# Altium project AudioDSP-v3.1.1.PrjPcb
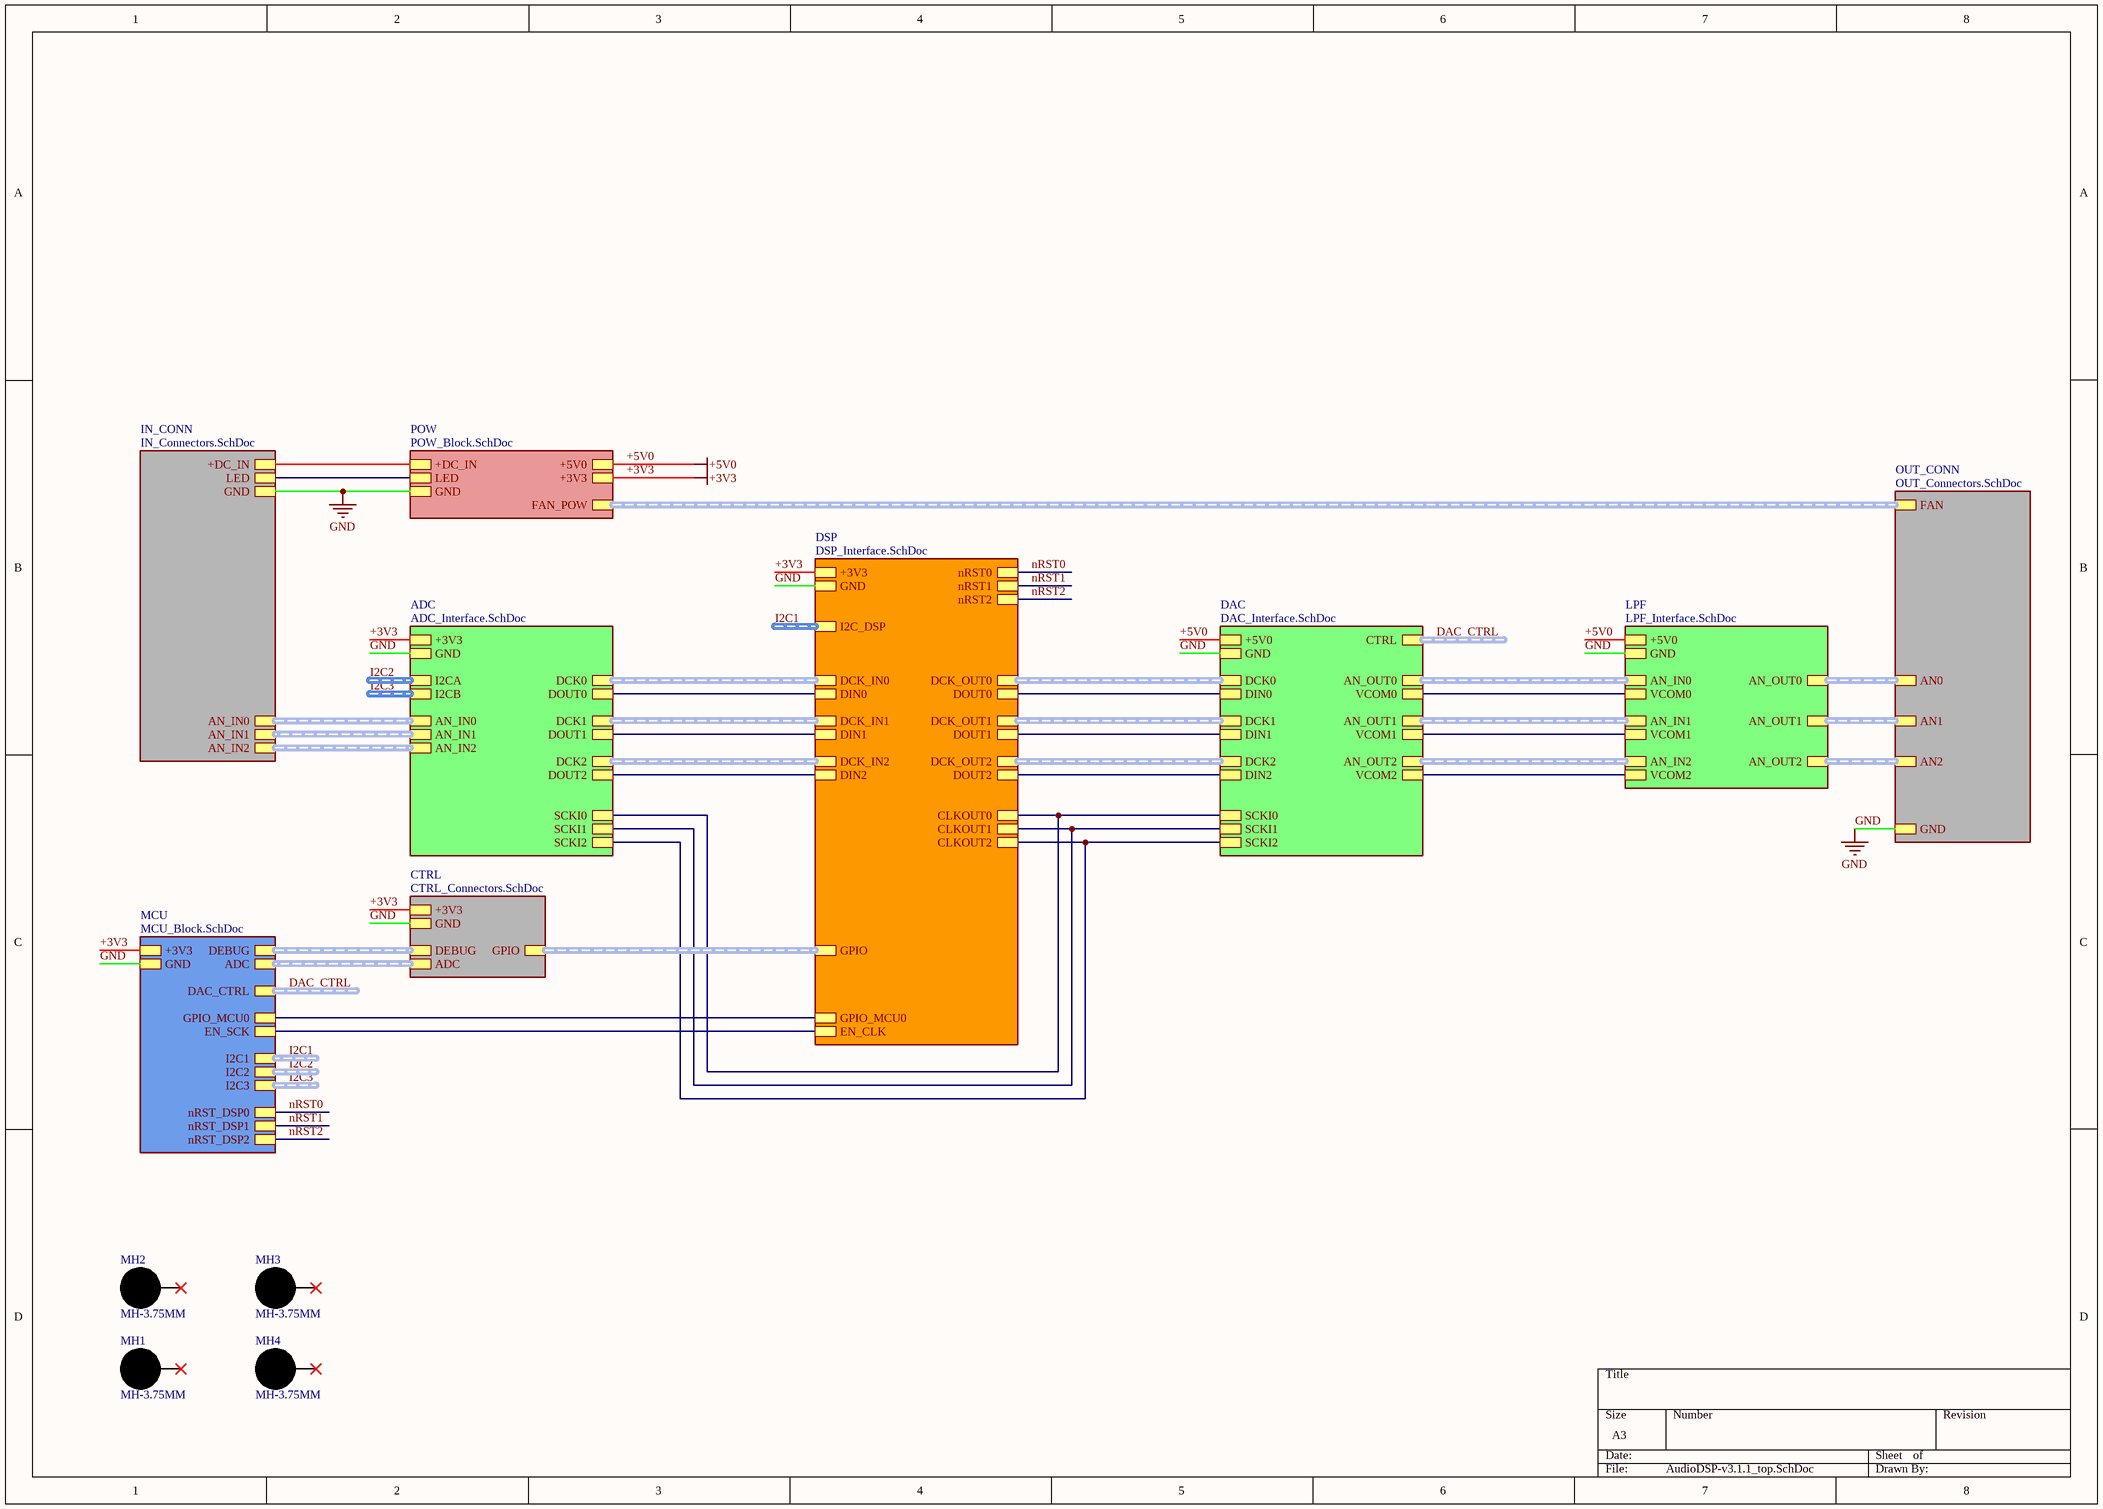
[diagram p0: AudioDSP-v3.1.1_top.SchDoc]
15 sheets, 329 parts. Net scope: strictly hierarchical (ports join the sheet entries above them; power ports are local).
Board file: AudioDSP-v3.1.1.PcbDoc
Sheets:
  AudioDSP-v3.1.1_top.SchDoc
    CTRL = CTRL_Connectors.SchDoc
    MCU = MCU_Block.SchDoc
    DSP = DSP_Interface.SchDoc
      DSP0 = DSP_Block.SchDoc
      DSP1 = DSP_Block.SchDoc
      DSP2 = DSP_Block.SchDoc
      CLK = CLK_Block.SchDoc
    DAC = DAC_Interface.SchDoc
      DAC0 = DAC_Block.SchDoc
      DAC1 = DAC_Block.SchDoc
      DAC2 = DAC_Block.SchDoc
    IN_CONN = IN_Connectors.SchDoc
    ADC = ADC_Interface.SchDoc
      ADC0 = ADC_Block.SchDoc
      ADC1 = ADC_Block.SchDoc
      ADC2 = ADC_Block.SchDoc
    LPF = LPF_Interface.SchDoc
      LPF0 = LPF_Block.SchDoc
      LPF1 = LPF_Block.SchDoc
      LPF2 = LPF_Block.SchDoc
    OUT_CONN = OUT_Connectors.SchDoc
    POW = POW_Block.SchDoc

## Sheet AudioDSP-v3.1.1_top.SchDoc
size A3; SheetNumber: 1; SheetTotal: 15

### Parts
MH1  MH-3.75MM  [MH-3.75mm-NP]  (no BOM)
MH2  MH-3.75MM  [MH-3.75mm-NP]  (no BOM)
MH3  MH-3.75MM  [MH-3.75mm-NP - SMALL]  (no BOM)
MH4  MH-3.75MM  [MH-3.75mm-NP]  (no BOM)

### Sub-sheets
ADC = ADC_Interface.SchDoc: +3V3, GND, I2CA (harness I2C), AN_IN0 (harness AN), SCKI0, I2CB (harness I2C), AN_IN1 (harness AN), AN_IN2 (harness AN), SCKI1, SCKI2, DCK0 (harness DCK), DOUT0, DCK1 (harness DCK), DOUT1, DCK2 (harness DCK), DOUT2
CTRL = CTRL_Connectors.SchDoc: DEBUG (harness SW), +3V3, GND, ADC (harness ADC), GPIO (harness GPIO)
DAC = DAC_Interface.SchDoc: +5V0, GND, SCKI0, SCKI1, SCKI2, DCK0 (harness DCK), DIN0, DCK1 (harness DCK), DIN1, DCK2 (harness DCK), DIN2, AN_OUT0 (harness AN), VCOM0, AN_OUT1 (harness AN), VCOM1, AN_OUT2 (harness AN), VCOM2, CTRL (harness DAC_CTRL)
DSP = DSP_Interface.SchDoc: +3V3, GND, I2C_DSP (harness I2C), nRST0, nRST1, nRST2, DCK_IN0 (harness DCK), DIN0, DCK_IN1 (harness DCK), DIN1, DCK_IN2 (harness DCK), DIN2, GPIO_MCU0, GPIO (harness GPIO), CLKOUT0, CLKOUT1, CLKOUT2, DCK_OUT0 (harness DCK), DOUT0, DCK_OUT1 (harness DCK), DOUT1, DCK_OUT2 (harness DCK), DOUT2, EN_CLK
IN_CONN = IN_Connectors.SchDoc: +DC_IN, GND, AN_IN0 (harness AN), LED, AN_IN1 (harness AN), AN_IN2 (harness AN)
LPF = LPF_Interface.SchDoc: +5V0, GND, AN_IN0 (harness AN), VCOM0, AN_IN1 (harness AN), VCOM1, AN_IN2 (harness AN), VCOM2, AN_OUT0 (harness AN), AN_OUT1 (harness AN), AN_OUT2 (harness AN)
MCU = MCU_Block.SchDoc: +3V3, GND, DEBUG (harness SW), ADC (harness ADC), I2C1 (harness I2C), I2C2 (harness I2C), I2C3 (harness I2C), nRST_DSP0, GPIO_MCU0, nRST_DSP1, nRST_DSP2, DAC_CTRL (harness DAC_CTRL), EN_SCK
OUT_CONN = OUT_Connectors.SchDoc: AN0 (harness AN), GND, AN1 (harness AN), AN2 (harness AN), FAN (harness FAN)
POW = POW_Block.SchDoc: +DC_IN, GND, +5V0, +3V3, LED, FAN_POW (harness FAN)

### Nets
+3V3: sheet CTRL/+3V3, sheet MCU/+3V3, sheet DSP/+3V3, sheet ADC/+3V3, sheet POW/+3V3
+5V0: sheet DAC/+5V0, sheet LPF/+5V0, sheet POW/+5V0
GND: sheet CTRL/GND, sheet MCU/GND, sheet DSP/GND, sheet DAC/GND, sheet IN_CONN/GND, sheet ADC/GND, sheet LPF/GND, sheet OUT_CONN/GND, sheet POW/GND
+DC_IN: sheet IN_CONN/+DC_IN, sheet POW/+DC_IN
DATA: sheet DSP/DOUT0, sheet DAC/DIN0
DATA: sheet DSP/DOUT1, sheet DAC/DIN1  [a separate net that carries the same name]
DATA: sheet DSP/DOUT2, sheet DAC/DIN2  [a separate net that carries the same name]
DIN0: sheet DSP/DIN0, sheet ADC/DOUT0
DIN0: sheet DSP/DIN1, sheet ADC/DOUT1  [a separate net that carries the same name]
DIN0: sheet DSP/DIN2, sheet ADC/DOUT2  [a separate net that carries the same name]
EN_SCK: sheet MCU/EN_SCK, sheet DSP/EN_CLK
GPIO_MCU0: sheet MCU/GPIO_MCU0, sheet DSP/GPIO_MCU0
nRST0: sheet MCU/nRST_DSP0, sheet DSP/nRST0
nRST1: sheet MCU/nRST_DSP1, sheet DSP/nRST1
nRST2: sheet MCU/nRST_DSP2, sheet DSP/nRST2
SCKI0: sheet DSP/CLKOUT0, sheet DAC/SCKI0, sheet ADC/SCKI0
SCKI1: sheet DSP/CLKOUT1, sheet DAC/SCKI1, sheet ADC/SCKI1
SCKI2: sheet DSP/CLKOUT2, sheet DAC/SCKI2, sheet ADC/SCKI2
VCOM: sheet DAC/VCOM0, sheet LPF/VCOM0
VCOM: sheet DAC/VCOM1, sheet LPF/VCOM1  [a separate net that carries the same name]
VCOM: sheet DAC/VCOM2, sheet LPF/VCOM2  [a separate net that carries the same name]
NetJ2_3: sheet IN_CONN/LED, sheet POW/LED

Not connected (* = marked no-connect by the designer): MH1 1*; MH2 1*; MH3 1*; MH4 1*

### Buses and harness runs
harness DAC_CTRL = sheet DAC/CTRL
harness DAC_CTRL = sheet MCU/DAC_CTRL
harness I2C1 = sheet DSP/I2C_DSP
harness I2C1 = sheet MCU/I2C1
harness I2C2 = sheet ADC/I2CA
harness I2C2 = sheet MCU/I2C2
harness I2C3 = sheet ADC/I2CB
harness I2C3 = sheet MCU/I2C3
harness sheet ADC/AN_IN0 = sheet IN_CONN/AN_IN0
harness sheet ADC/AN_IN1 = sheet IN_CONN/AN_IN1
harness sheet ADC/AN_IN2 = sheet IN_CONN/AN_IN2
harness sheet ADC/DCK0 = sheet DSP/DCK_IN0
harness sheet ADC/DCK1 = sheet DSP/DCK_IN1
harness sheet ADC/DCK2 = sheet DSP/DCK_IN2
harness sheet CTRL/ADC = sheet MCU/ADC
harness sheet CTRL/DEBUG = sheet MCU/DEBUG
harness sheet CTRL/GPIO = sheet DSP/GPIO
harness sheet DAC/AN_OUT0 = sheet LPF/AN_IN0
harness sheet DAC/AN_OUT1 = sheet LPF/AN_IN1
harness sheet DAC/AN_OUT2 = sheet LPF/AN_IN2
harness sheet DAC/DCK0 = sheet DSP/DCK_OUT0
harness sheet DAC/DCK1 = sheet DSP/DCK_OUT1
harness sheet DAC/DCK2 = sheet DSP/DCK_OUT2
harness sheet LPF/AN_OUT0 = sheet OUT_CONN/AN0
harness sheet LPF/AN_OUT1 = sheet OUT_CONN/AN1
harness sheet LPF/AN_OUT2 = sheet OUT_CONN/AN2
harness sheet OUT_CONN/FAN = sheet POW/FAN_POW

### Library data of the parts
MH1-MH4 = MH-3.75MM: ClassName: MountHole

## Sheet CTRL_Connectors.SchDoc
size A4; SheetNumber: 4; SheetTotal: 15
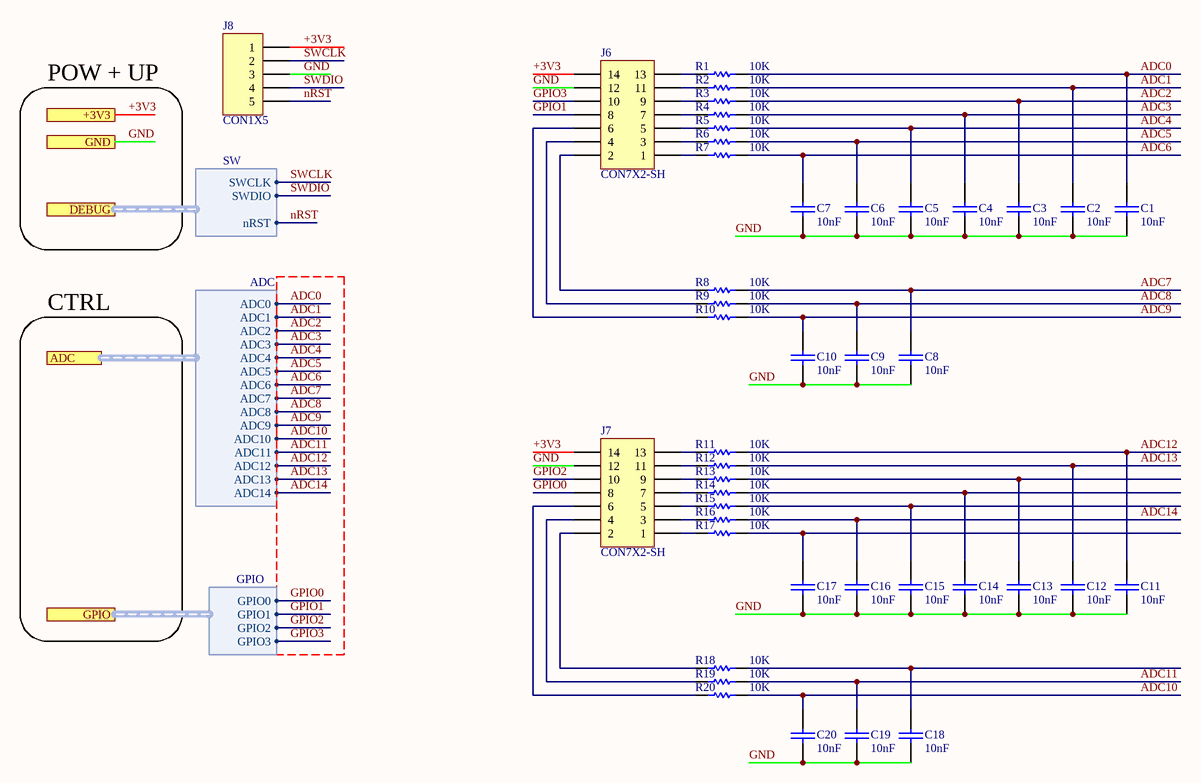
[diagram p1: CTRL_Connectors.SchDoc]

### Parts
(Parts that share a designator on the sheet are numbered #1, #2 ... from top to bottom, then left to right.)
C1#1  10nF  [0402-CAP-TDK]
C2#1  10nF  [0402-CAP-TDK]
C3#1  10nF  [0402-CAP-TDK]
C4#1  10nF  [0402-CAP-TDK]
C5#1  10nF  [0402-CAP-TDK]
C6#1  10nF  [0402-CAP-TDK]
C7#1  10nF  [0402-CAP-TDK]
C8#1  10nF  [0402-CAP-TDK]
C9#1  10nF  [0402-CAP-TDK]
C10  10nF  [0402-CAP-TDK]
C11  10nF  [0402-CAP-TDK]
C12  10nF  [0402-CAP-TDK]
C13  10nF  [0402-CAP-TDK]
C14  10nF  [0402-CAP-TDK]
C15  10nF  [0402-CAP-TDK]
C16  10nF  [0402-CAP-TDK]
C17  10nF  [0402-CAP-TDK]
C18  10nF  [0402-CAP-TDK]
C19  10nF  [0402-CAP-TDK]
C20  10nF  [0402-CAP-TDK]
J6  CON7X2-SH  [SIP7X2-SH]
J7  CON7X2-SH  [SIP7X2-SH]
J8  CON1X5  [SIP1X5]
R1#1  10K  [0402-RES-PANASONIC]
R2#1  10K  [0402-RES-PANASONIC]
R3#1  10K  [0402-RES-PANASONIC]
R4#1  10K  [0402-RES-PANASONIC]
R5#1  10K  [0402-RES-PANASONIC]
R6#1  10K  [0402-RES-PANASONIC]
R7#1  10K  [0402-RES-PANASONIC]
R8#1  10K  [0402-RES-PANASONIC]
R9#1  10K  [0402-RES-PANASONIC]
R10#1  10K  [0402-RES-PANASONIC]
R11  10K  [0402-RES-PANASONIC]
R12  10K  [0402-RES-PANASONIC]
R13  10K  [0402-RES-PANASONIC]
R14  10K  [0402-RES-PANASONIC]
R15  10K  [0402-RES-PANASONIC]
R16  10K  [0402-RES-PANASONIC]
R17  10K  [0402-RES-PANASONIC]
R18  10K  [0402-RES-PANASONIC]
R19  10K  [0402-RES-PANASONIC]
R20  10K  [0402-RES-PANASONIC]

### Ports
+3V3, ADC (harness ADC), DEBUG (harness SW), GND, GPIO (harness GPIO)

### Harnesses
SW: SWCLK, SWDIO, nRST
ADC: ADC0, ADC1, ADC2, ADC3, ADC4, ADC5, ADC6, ADC7, ADC8, ADC9, ADC10, ADC11, ADC12, ADC13, ADC14
GPIO: GPIO0, GPIO1, GPIO2, GPIO3

### Nets
+3V3: J6.14 J7.14 J8.1 ; port +3V3
GND: C1#1.1 C2#1.1 C3#1.1 C4#1.1 C5#1.1 C6#1.1 C7#1.1 C8#1.1 C9#1.1 C10.1 C11.1 C12.1 C13.1 C14.1 C15.1 C16.1 C17.1 C18.1 C19.1 C20.1 J6.12 J7.12 J8.3 ; port GND
ADC0: C1#1.2 R1#1.2 ; port ADC.ADC0
ADC1: C2#1.2 R2#1.2 ; port ADC.ADC1
ADC2: C3#1.2 R3#1.2 ; port ADC.ADC2
ADC3: C4#1.2 R4#1.2 ; port ADC.ADC3
ADC4: C5#1.2 R5#1.2 ; port ADC.ADC4
ADC5: C6#1.2 R6#1.2 ; port ADC.ADC5
ADC6: C7#1.2 R7#1.2 ; port ADC.ADC6
ADC7: C8#1.2 R8#1.2 ; port ADC.ADC7
ADC8: C9#1.2 R9#1.2 ; port ADC.ADC8
ADC9: C10.2 R10#1.2 ; port ADC.ADC9
ADC10: C20.2 R20.2 ; port ADC.ADC10
ADC11: C19.2 R19.2 ; port ADC.ADC11
ADC12: C11.2 R11.2 ; port ADC.ADC12
ADC13: C12.2 R12.2 ; port ADC.ADC13
ADC14: C16.2 R16.2 ; port ADC.ADC14
GPIO0: J7.8 ; port GPIO.GPIO0
GPIO1: J6.8 ; port GPIO.GPIO1
GPIO2: J7.10 ; port GPIO.GPIO2
GPIO3: J6.10 ; port GPIO.GPIO3
nRST: J8.5 ; port DEBUG.nRST
SWCLK: J8.2 ; port DEBUG.SWCLK
SWDIO: J8.4 ; port DEBUG.SWDIO
NetC13_2: C13.2 R13.2
NetC14_2: C14.2 R14.2
NetC15_2: C15.2 R15.2
NetC17_2: C17.2 R17.2
NetC18_2: C18.2 R18.2
NetJ6_1: J6.1 R7#1.1
NetJ6_2: J6.2 R8#1.1
NetJ6_3: J6.3 R6#1.1
NetJ6_4: J6.4 R9#1.1
NetJ6_5: J6.5 R5#1.1
NetJ6_6: J6.6 R10#1.1
NetJ6_7: J6.7 R4#1.1
NetJ6_9: J6.9 R3#1.1
NetJ6_11: J6.11 R2#1.1
NetJ6_13: J6.13 R1#1.1
NetJ7_1: J7.1 R17.1
NetJ7_2: J7.2 R18.1
NetJ7_3: J7.3 R16.1
NetJ7_4: J7.4 R19.1
NetJ7_5: J7.5 R15.1
NetJ7_6: J7.6 R20.1
NetJ7_7: J7.7 R14.1
NetJ7_9: J7.9 R13.1
NetJ7_11: J7.11 R12.1
NetJ7_13: J7.13 R11.1

### Notes on the sheet
- POW + UP
- CTRL

### Library data of the parts
C1#1 C2#1 C3#1 C4#1 C5#1 C6#1 C7#1 C8#1 C9#1 C10-C20 = CAP-SMD: JLCPart: C15195
J6 J7 = CON7X2-SH: Connector Header Through Hole 14 position 0.100" (2.54mm)
R1#1 R2#1 R3#1 R4#1 R5#1 R6#1 R7#1 R8#1 R9#1 R10#1 R11-R20 = RES-SMD: JLCPart: C25744

## Sheet MCU_Block.SchDoc
size A4; SheetNumber: 3; SheetTotal: 15
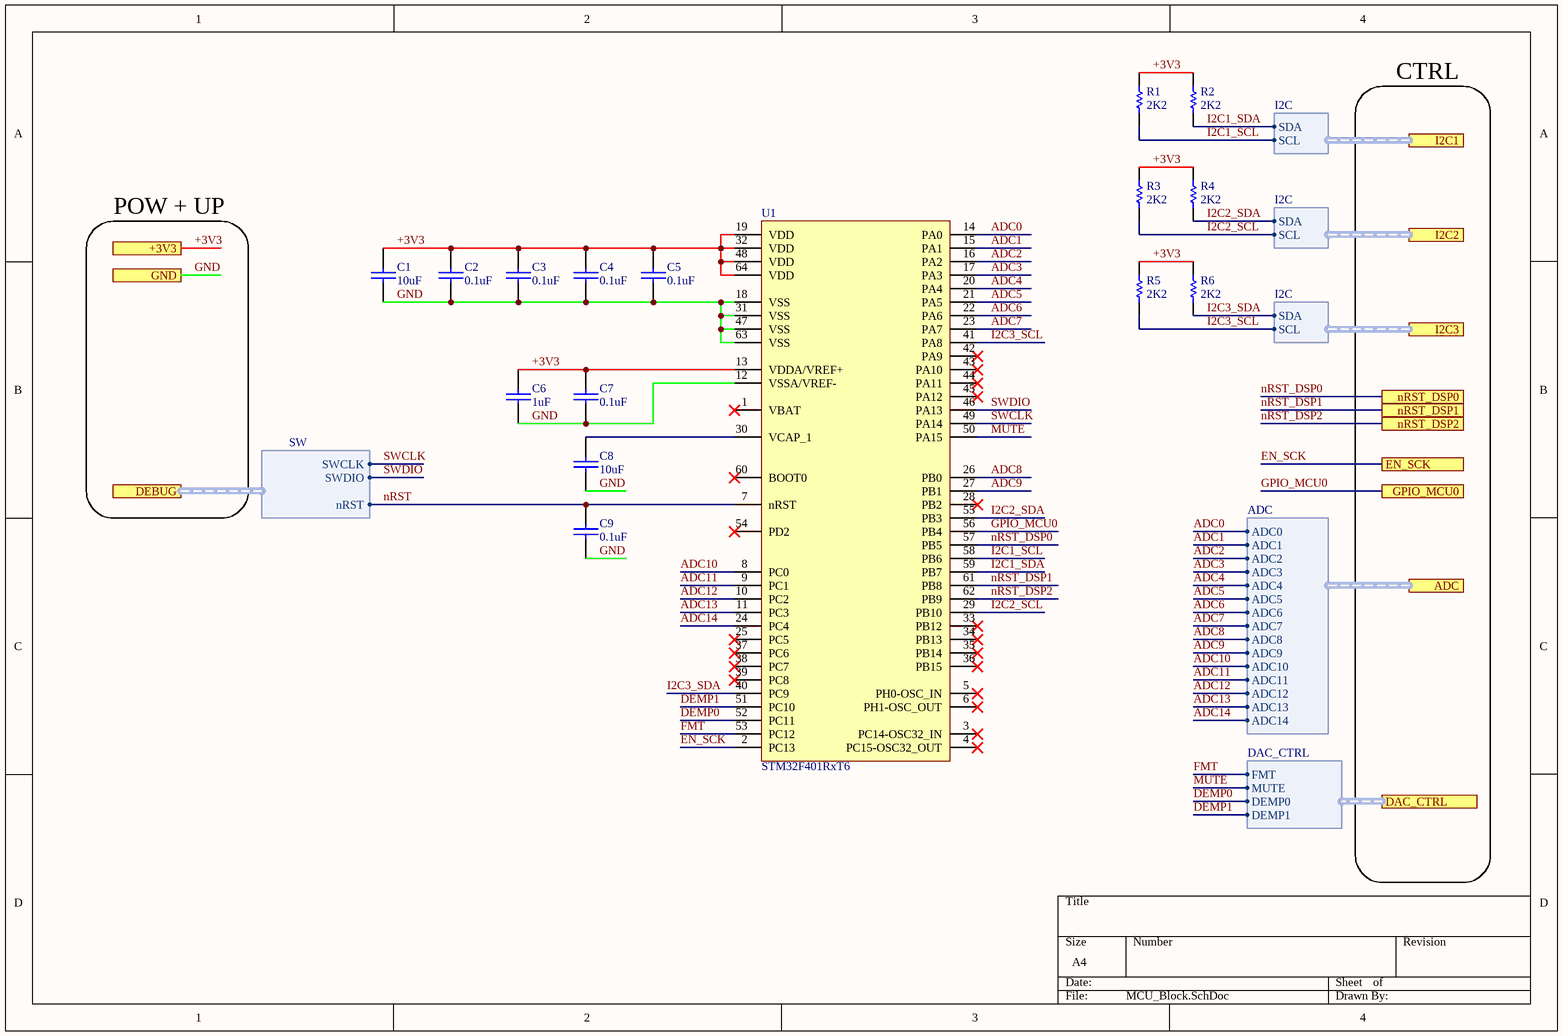
[diagram p2: MCU_Block.SchDoc]

### Parts
(Parts that share a designator on the sheet are numbered #1, #2 ... from top to bottom, then left to right.)
C1#2  10uF  [0603-CAP-TDK]
C2#2  0.1uF  [0402-CAP-TDK]
C3#2  0.1uF  [0402-CAP-TDK]
C4#2  0.1uF  [0402-CAP-TDK]
C5#2  0.1uF  [0402-CAP-TDK]
C6#2  1uF  [0603-CAP-TDK]
C7#2  0.1uF  [0402-CAP-TDK]
C8#2  10uF  [0603-CAP-TDK]
C9#2  0.1uF  [0402-CAP-TDK]
R1#2  2K2  [0402-RES-PANASONIC]
R2#2  2K2  [0402-RES-PANASONIC]
R3#2  2K2  [0402-RES-PANASONIC]
R4#2  2K2  [0402-RES-PANASONIC]
R5#2  2K2  [0402-RES-PANASONIC]
R6#2  2K2  [0402-RES-PANASONIC]
U1#1  STM32F401RxT6  [LQFP-64]

### Ports
+3V3, ADC (harness ADC), DAC_CTRL (harness DAC_CTRL), DEBUG (harness SW), EN_SCK, GND, GPIO_MCU0, I2C1 (harness I2C), I2C2 (harness I2C), I2C3 (harness I2C), nRST_DSP0, nRST_DSP1, nRST_DSP2

### Harnesses
SW: SWCLK, SWDIO, nRST
ADC: ADC0, ADC1, ADC2, ADC3, ADC4, ADC5, ADC6, ADC7, ADC8, ADC9, ADC10, ADC11, ADC12, ADC13, ADC14
I2C: SCL, SDA
DAC_CTRL: FMT, MUTE, DEMP0, DEMP1

### Nets
+3V3: C1#2.2 C2#2.2 C3#2.2 C4#2.2 C5#2.2 C6#2.2 C7#2.2 R1#2.2 R2#2.2 R3#2.2 R4#2.2 R5#2.2 R6#2.2 U1#1.13(VDDA/VREF+) U1#1.19(VDD) U1#1.32(VDD) U1#1.48(VDD) U1#1.64(VDD) ; port +3V3
GND: C1#2.1 C2#2.1 C3#2.1 C4#2.1 C5#2.1 C6#2.1 C7#2.1 C8#2.1 C9#2.1 U1#1.12(VSSA/VREF-) U1#1.18(VSS) U1#1.31(VSS) U1#1.47(VSS) U1#1.63(VSS) ; port GND
ADC0: U1#1.14(PA0) ; port ADC.ADC0
ADC1: U1#1.15(PA1) ; port ADC.ADC1
ADC2: U1#1.16(PA2) ; port ADC.ADC2
ADC3: U1#1.17(PA3) ; port ADC.ADC3
ADC4: U1#1.20(PA4) ; port ADC.ADC4
ADC5: U1#1.21(PA5) ; port ADC.ADC5
ADC6: U1#1.22(PA6) ; port ADC.ADC6
ADC7: U1#1.23(PA7) ; port ADC.ADC7
ADC8: U1#1.26(PB0) ; port ADC.ADC8
ADC9: U1#1.27(PB1) ; port ADC.ADC9
ADC10: U1#1.8(PC0) ; port ADC.ADC10
ADC11: U1#1.9(PC1) ; port ADC.ADC11
ADC12: U1#1.10(PC2) ; port ADC.ADC12
ADC13: U1#1.11(PC3) ; port ADC.ADC13
ADC14: U1#1.24(PC4) ; port ADC.ADC14
DEMP0: U1#1.52(PC11) ; port DAC_CTRL.DEMP0  [project net DAC_CTRL.DEMP0]
DEMP1: U1#1.51(PC10) ; port DAC_CTRL.DEMP1  [project net DAC_CTRL.DEMP1]
EN_SCK: U1#1.2(PC13) ; port EN_SCK
FMT: U1#1.53(PC12) ; port DAC_CTRL.FMT  [project net DAC_CTRL.FMT]
GPIO_MCU0: U1#1.56(PB4) ; port GPIO_MCU0
I2C1_SCL: R1#2.1 U1#1.58(PB6) ; port I2C1.SCL  [project net I2C1.SCL]
I2C1_SDA: R2#2.1 U1#1.59(PB7) ; port I2C1.SDA  [project net I2C1.SDA]
I2C2_SCL: R3#2.1 U1#1.29(PB10) ; port I2C2.SCL  [project net I2C2.SCL]
I2C2_SDA: R4#2.1 U1#1.55(PB3) ; port I2C2.SDA  [project net I2C2.SDA]
I2C3_SCL: R5#2.1 U1#1.41(PA8) ; port I2C3.SCL  [project net I2C3.SCL]
I2C3_SDA: R6#2.1 U1#1.40(PC9) ; port I2C3.SDA  [project net I2C3.SDA]
MUTE: U1#1.50(PA15) ; port DAC_CTRL.MUTE  [project net DAC_CTRL.MUTE]
nRST: C9#2.2 U1#1.7(nRST) ; port DEBUG.nRST
nRST_DSP0: U1#1.57(PB5) ; port nRST_DSP0  [project net nRST0]
nRST_DSP1: U1#1.61(PB8) ; port nRST_DSP1  [project net nRST1]
nRST_DSP2: U1#1.62(PB9) ; port nRST_DSP2  [project net nRST2]
SWCLK: U1#1.49(PA14) ; port DEBUG.SWCLK
SWDIO: U1#1.46(PA13) ; port DEBUG.SWDIO
NetC8#2_2: C8#2.2 U1#1.30(VCAP_1)

Not connected (* = marked no-connect by the designer): U1#1 1(VBAT)* 3(PC14-OSC32_IN)* 4(PC15-OSC32_OUT)* 5(PH0-OSC_IN)* 6(PH1-OSC_OUT)* 25(PC5)* 28(PB2)* 33(PB12)* 34(PB13)* 35(PB14)* 36(PB15)* 37(PC6)* 38(PC7)* 39(PC8)* 42(PA9)* 43(PA10)* 44(PA11)* 45(PA12)* 54(PD2)* 60(BOOT0)*

### Notes on the sheet
- CTRL
- POW + UP

### Library data of the parts
C1#2 C2#2 C3#2 C4#2 C5#2 C6#2 C7#2 C8#2 C9#2 = CAP-SMD
  C1#2 C8#2: JLCPart: C96446
  C2#2 C3#2 C4#2 C5#2 C7#2 C9#2: JLCPart: C307331
  C6#2: JLCPart: C15849
R1#2 R2#2 R3#2 R4#2 R5#2 R6#2 = RES-SMD: JLCPart: C25879
U1#1 = STM32F401RxT6: JLCPart: C74524

## Sheet DSP_Interface.SchDoc
size A4; SheetNumber: 9; SheetTotal: 15
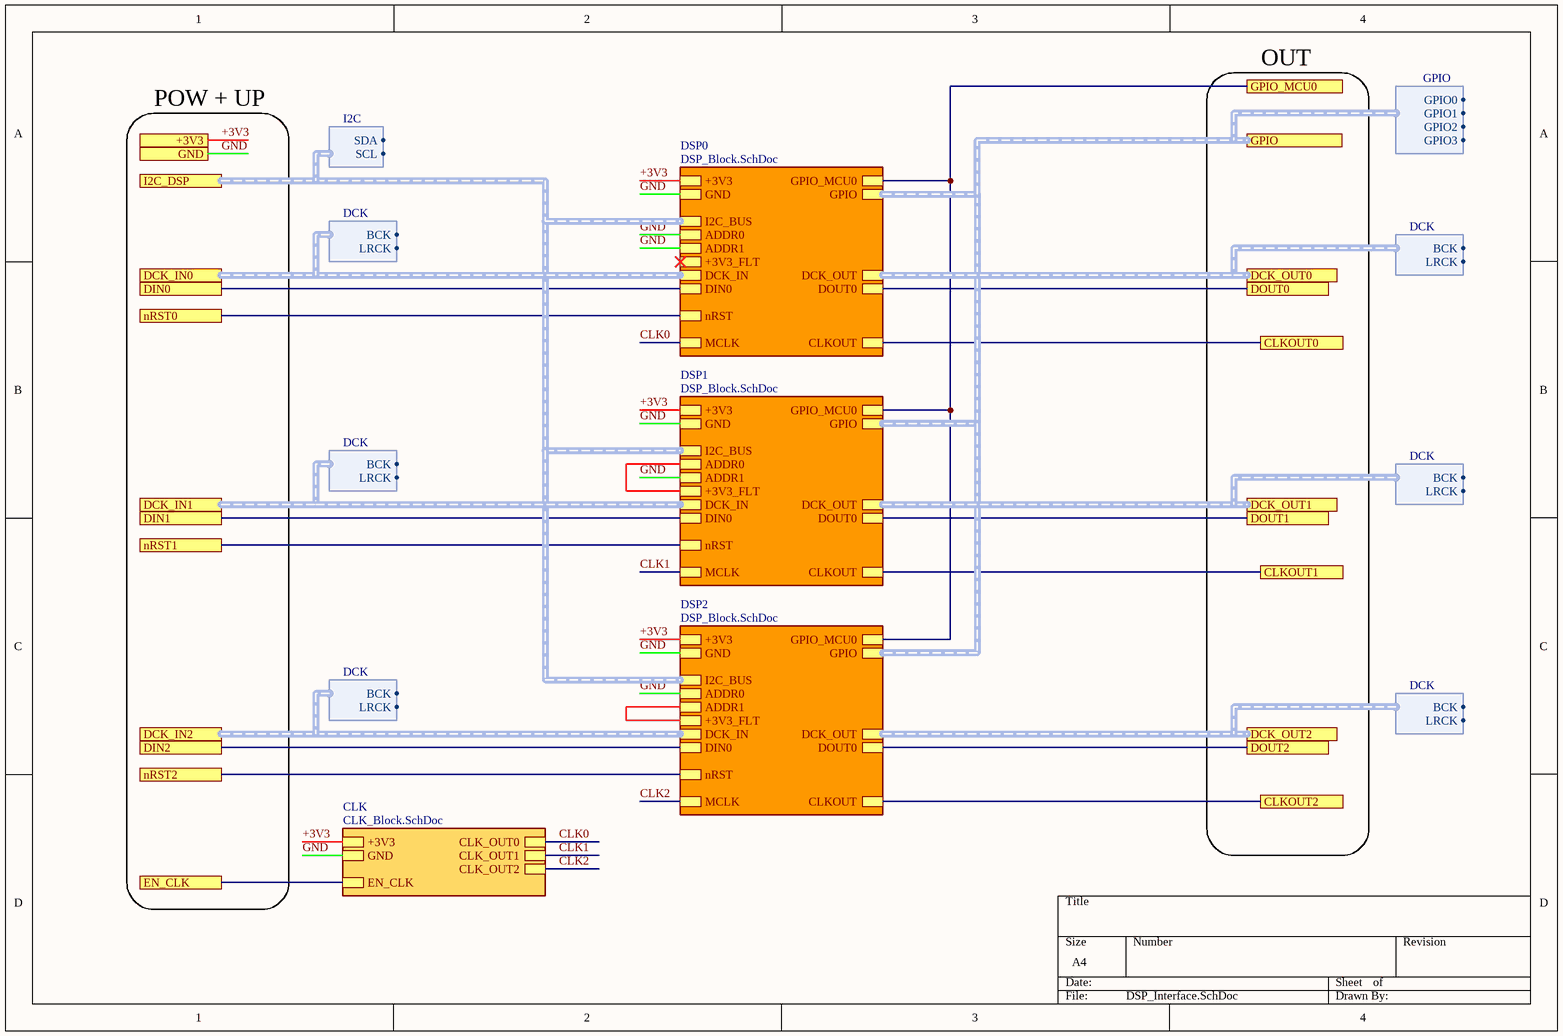
[diagram p3: DSP_Interface.SchDoc]

### Sub-sheets
CLK = CLK_Block.SchDoc: +3V3, GND, EN_CLK, CLK_OUT0, CLK_OUT1, CLK_OUT2
DSP0 = DSP_Block.SchDoc: +3V3, GND, CLKOUT, nRST, ADDR0, ADDR1, I2C_BUS (harness I2C), DCK_IN (harness DCK), DIN0, DCK_OUT (harness DCK), DOUT0, GPIO (harness GPIO), MCLK, GPIO_MCU0, +3V3_FLT
DSP1 = DSP_Block.SchDoc: +3V3, GND, CLKOUT, nRST, ADDR0, ADDR1, I2C_BUS (harness I2C), DCK_IN (harness DCK), DIN0, DCK_OUT (harness DCK), DOUT0, GPIO (harness GPIO), MCLK, GPIO_MCU0, +3V3_FLT
DSP2 = DSP_Block.SchDoc: +3V3, GND, CLKOUT, nRST, ADDR0, ADDR1, I2C_BUS (harness I2C), DCK_IN (harness DCK), DIN0, DCK_OUT (harness DCK), DOUT0, GPIO (harness GPIO), MCLK, GPIO_MCU0, +3V3_FLT

### Ports
+3V3, CLKOUT0, CLKOUT1, CLKOUT2, DCK_IN0 (harness DCK), DCK_IN1 (harness DCK), DCK_IN2 (harness DCK), DCK_OUT0 (harness DCK), DCK_OUT1 (harness DCK), DCK_OUT2 (harness DCK), DIN0, DIN1, DIN2, DOUT0, DOUT1, DOUT2, EN_CLK, GND, GPIO (harness GPIO), GPIO_MCU0, I2C_DSP (harness I2C), nRST0, nRST1, nRST2

### Harnesses
DCK: BCK, LRCK
GPIO: GPIO0, GPIO1, GPIO2, GPIO3
I2C: SCL, SDA

### Nets
+3V3: port +3V3, sheet DSP0/+3V3, sheet DSP1/+3V3, sheet DSP2/+3V3, sheet CLK/+3V3
GND: port GND, sheet DSP0/GND, sheet DSP0/ADDR0, sheet DSP0/ADDR1, sheet DSP1/GND, sheet DSP1/ADDR1, sheet DSP2/GND, sheet DSP2/ADDR0, sheet CLK/GND
+3V3_FLT_DSP1: sheet DSP1/ADDR0, sheet DSP1/+3V3_FLT
+3V3_FLT_DSP2: sheet DSP2/ADDR1, sheet DSP2/+3V3_FLT
CLK0: sheet DSP0/MCLK, sheet CLK/CLK_OUT0
CLK1: sheet DSP1/MCLK, sheet CLK/CLK_OUT1
CLK2: sheet DSP2/MCLK, sheet CLK/CLK_OUT2
DATA: port DOUT0, sheet DSP0/DOUT0
DATA: port DOUT1, sheet DSP1/DOUT0  [a separate net that carries the same name]
DATA: port DOUT2, sheet DSP2/DOUT0  [a separate net that carries the same name]
DIN0: port DIN0, sheet DSP0/DIN0
DIN0: port DIN1, sheet DSP1/DIN0  [a separate net that carries the same name]
DIN0: port DIN2, sheet DSP2/DIN0  [a separate net that carries the same name]
EN_SCK: port EN_CLK, sheet CLK/EN_CLK
GPIO_MCU0: port GPIO_MCU0, sheet DSP0/GPIO_MCU0, sheet DSP1/GPIO_MCU0, sheet DSP2/GPIO_MCU0
nRST0: port nRST0, sheet DSP0/nRST
nRST1: port nRST1, sheet DSP1/nRST
nRST2: port nRST2, sheet DSP2/nRST
SCKI0: port CLKOUT0, sheet DSP0/CLKOUT
SCKI1: port CLKOUT1, sheet DSP1/CLKOUT
SCKI2: port CLKOUT2, sheet DSP2/CLKOUT

### Buses and harness runs
harness port DCK_IN0 = sheet DSP0/DCK_IN
harness port DCK_IN1 = sheet DSP1/DCK_IN
harness port DCK_IN2 = sheet DSP2/DCK_IN
harness port DCK_OUT0 = sheet DSP0/DCK_OUT
harness port DCK_OUT1 = sheet DSP1/DCK_OUT
harness port DCK_OUT2 = sheet DSP2/DCK_OUT
harness port GPIO = sheet DSP0/GPIO = sheet DSP1/GPIO = sheet DSP2/GPIO
harness port I2C_DSP = sheet DSP0/I2C_BUS = sheet DSP1/I2C_BUS = sheet DSP2/I2C_BUS

### Notes on the sheet
- POW + UP
- OUT

## Sheet DSP_Block.SchDoc
size A4; SheetNumber: 10; SheetTotal: 15
Used 3 times, as channels DSP/DSP0, DSP/DSP1, DSP/DSP2. Parts and nets are listed once, with the designators drawn on the sheet.
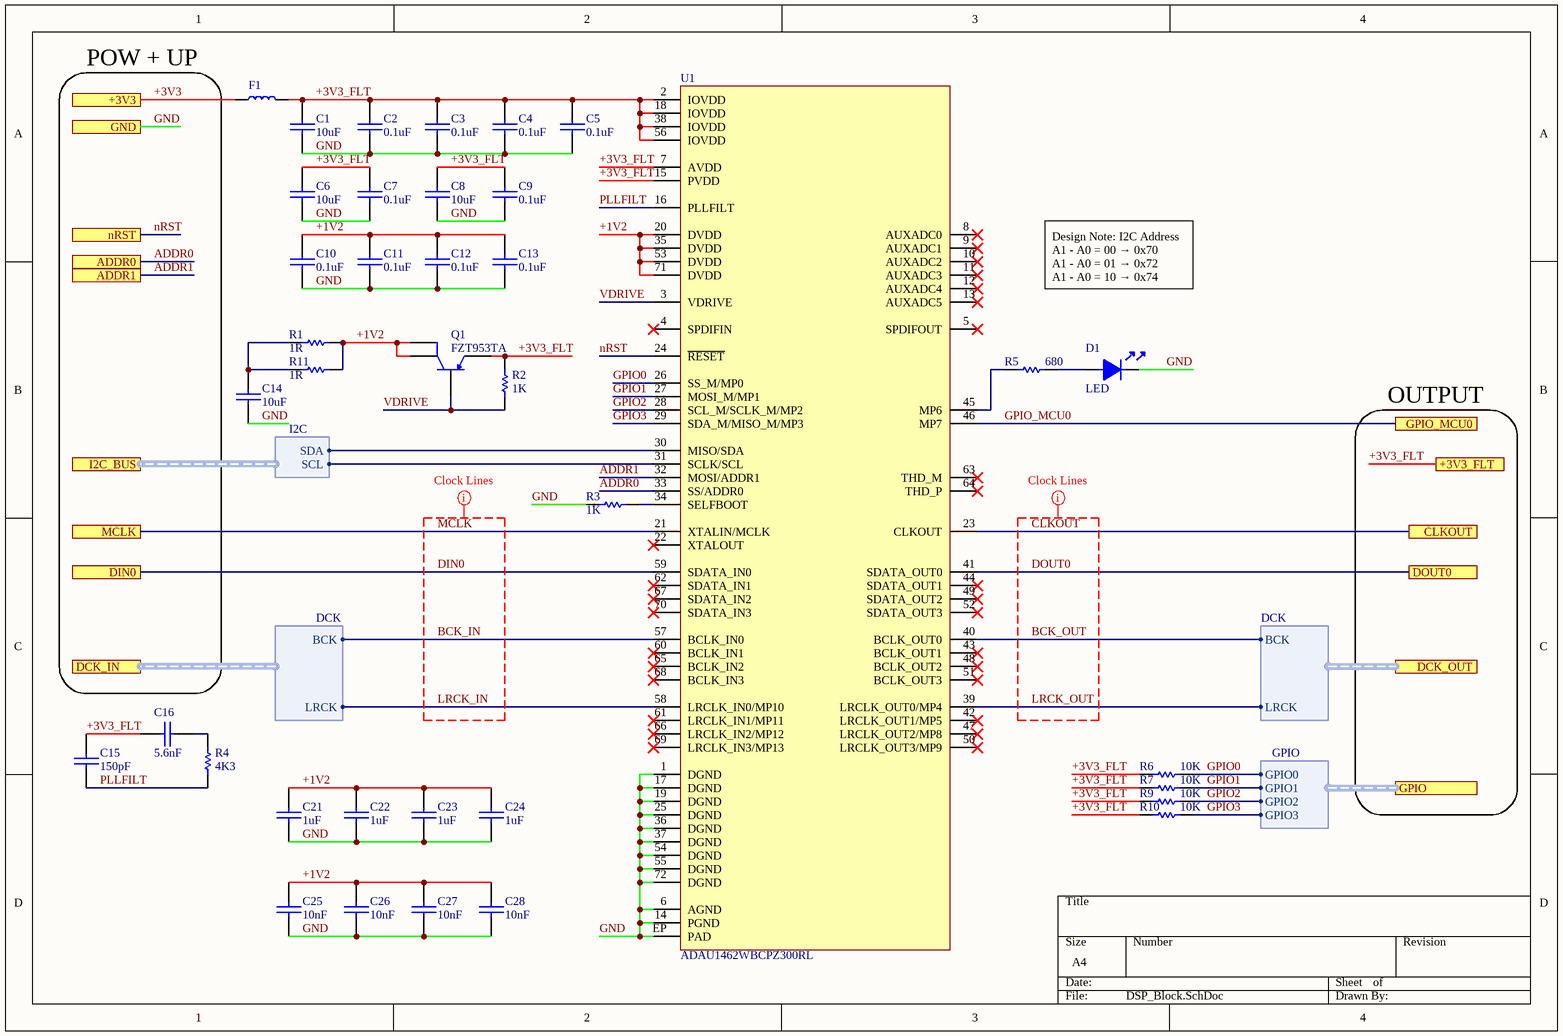
[diagram p4: DSP_Block.SchDoc]

### Parts
C1  10uF  [0402-CAP-TDK]
C2  0.1uF  [0402-CAP-TDK]
C3  0.1uF  [0402-CAP-TDK]
C4  0.1uF  [0402-CAP-TDK]
C5  0.1uF  [0402-CAP-TDK]
C6  10uF  [0402-CAP-TDK]
C7  0.1uF  [0402-CAP-TDK]
C8  10uF  [0402-CAP-TDK]
C9  0.1uF  [0402-CAP-TDK]
C10  0.1uF  [0402-CAP-TDK]
C11  0.1uF  [0402-CAP-TDK]
C12  0.1uF  [0402-CAP-TDK]
C13  0.1uF  [0402-CAP-TDK]
C14  10uF  [0402-CAP-TDK]
C15  150pF  [0402-CAP-TDK]
C16  5.6nF  [0402-CAP-TDK]
C21  1uF  [0402-CAP-TDK]
C22  1uF  [0402-CAP-TDK]
C23  1uF  [0402-CAP-TDK]
C24  1uF  [0402-CAP-TDK]
C25  10nF  [0402-CAP-TDK]
C26  10nF  [0402-CAP-TDK]
C27  10nF  [0402-CAP-TDK]
C28  10nF  [0402-CAP-TDK]
D1  LED  [LED-0805]
F1  BLM18PG181SN1D  [0603-IND-MURATA]  (value not drawn)
Q1  FZT953TA  [SOT223-DN]
R1  1R  [0603-RES-PANASONIC]
R2  1K  [0402-RES-PANASONIC]
R3  1K  [0402-RES-PANASONIC]
R4  4K3  [0402-RES-PANASONIC]
R5  680  [0402-RES-PANASONIC]
R6  10K  [0402-RES-PANASONIC]
R7  10K  [0402-RES-PANASONIC]
R9  10K  [0402-RES-PANASONIC]
R10  10K  [0402-RES-PANASONIC]
R11  1R  [0603-RES-PANASONIC]
U1  ADAU1462WBCPZ300RL  [LFCSP-VQ-72]

### Ports
+3V3, +3V3_FLT, ADDR0, ADDR1, CLKOUT, DCK_IN (harness DCK), DCK_OUT (harness DCK), DIN0, DOUT0, GND, GPIO (harness GPIO), GPIO_MCU0, I2C_BUS (harness I2C), MCLK, nRST

### Harnesses
I2C: SCL, SDA
DCK: BCK, LRCK
GPIO: GPIO0, GPIO1, GPIO2, GPIO3

### Nets
+1V2: C10.2 C11.2 C12.2 C13.2 C21.2 C22.2 C23.2 C24.2 C25.2 C26.2 C27.2 C28.2 Q1.C Q1.C-TAB R1.1 R11.1 U1.20(DVDD) U1.35(DVDD) U1.53(DVDD) U1.71(DVDD)
+3V3: F1.2 ; port +3V3
+3V3_FLT: C1.2 C2.2 C3.2 C4.2 C5.2 C6.2 C7.2 C8.2 C9.2 C15.2 C16.2 F1.1 Q1.E R2.2 R6.1 R7.2 R9.1 R10.2 U1.2(IOVDD) U1.7(AVDD) U1.15(PVDD) U1.18(IOVDD) U1.38(IOVDD) U1.56(IOVDD) ; port +3V3_FLT
ADDR0: U1.33(SS/ADDR0) ; port ADDR0
ADDR1: U1.32(MOSI/ADDR1) ; port ADDR1
BCK_IN: U1.57(BCLK_IN0) ; port DCK_IN.BCK
BCK_OUT: U1.40(BCLK_OUT0) ; port DCK_OUT.BCK
CLKOUT: U1.23(CLKOUT) ; port CLKOUT
DIN0: U1.59(SDATA_IN0) ; port DIN0
DOUT0: U1.41(SDATA_OUT0) ; port DOUT0
GND: C1.1 C2.1 C3.1 C4.1 C5.1 C6.1 C7.1 C8.1 C9.1 C10.1 C11.1 C12.1 C13.1 C14.1 C21.1 C22.1 C23.1 C24.1 C25.1 C26.1 C27.1 C28.1 D1.2 R3.2 U1.1(DGND) U1.6(AGND) U1.14(PGND) U1.17(DGND) U1.19(DGND) U1.25(DGND) U1.36(DGND) U1.37(DGND) U1.54(DGND) U1.55(DGND) U1.72(DGND) U1.EP(PAD) ; port GND
GPIO0: R6.2 U1.26(SS_M/MP0) ; port GPIO.GPIO0
GPIO1: R7.1 U1.27(MOSI_M/MP1) ; port GPIO.GPIO1
GPIO2: R9.2 U1.28(SCL_M/SCLK_M/MP2) ; port GPIO.GPIO2
GPIO3: R10.1 U1.29(SDA_M/MISO_M/MP3) ; port GPIO.GPIO3
GPIO_MCU0: U1.46(MP7) ; port GPIO_MCU0
LRCK_IN: U1.58(LRCLK_IN0/MP10) ; port DCK_IN.LRCK
LRCK_OUT: U1.39(LRCLK_OUT0/MP4) ; port DCK_OUT.LRCK
MCLK: U1.21(XTALIN/MCLK) ; port MCLK
nRST: U1.24(~{RESET}) ; port nRST
PLLFILT: C15.1 R4.1 U1.16(PLLFILT)
VDRIVE: Q1.B R2.1 U1.3(VDRIVE)
NetC14_2: C14.2 R1.2 R11.2
NetC16_1: C16.1 R4.2
NetD1_1: D1.1 R5.2
NetR3_1: R3.1 U1.34(SELFBOOT)
NetR5_1: R5.1 U1.45(MP6)
NetU1_30: U1.30(MISO/SDA) ; port I2C_BUS.SDA
NetU1_31: U1.31(SCLK/SCL) ; port I2C_BUS.SCL

Not connected (* = marked no-connect by the designer): U1 4(SPDIFIN)* 5(SPDIFOUT)* 8(AUXADC0)* 9(AUXADC1)* 10(AUXADC2)* 11(AUXADC3)* 12(AUXADC4)* 13(AUXADC5)* 22(XTALOUT)* 42(LRCLK_OUT1/MP5)* 43(BCLK_OUT1)* 44(SDATA_OUT1)* 47(LRCLK_OUT2/MP8)* 48(BCLK_OUT2)* 49(SDATA_OUT2)* 50(LRCLK_OUT3/MP9)* 51(BCLK_OUT3)* 52(SDATA_OUT3)* 60(BCLK_IN1)* 61(LRCLK_IN1/MP11)* 62(SDATA_IN1)* 63(THD_M)* 64(THD_P)* 65(BCLK_IN2)* 66(LRCLK_IN2/MP12)* 67(SDATA_IN2)* 68(BCLK_IN3)* 69(LRCLK_IN3/MP13)* 70(SDATA_IN3)*

### Channels
DSP/DSP0: designators end in _DSP0; ports +3V3=+3V3 +3V3_FLT=+3V3_FLT_DSP0 ADDR0=GND ADDR1=GND CLKOUT=SCKI0 DIN0=DIN0 DOUT0=DATA GND=GND GPIO_MCU0=GPIO_MCU0 MCLK=CLK0 nRST=nRST0
DSP/DSP1: designators end in _DSP1; ports +3V3=+3V3 +3V3_FLT=+3V3_FLT_DSP1 ADDR0=+3V3_FLT_DSP1 ADDR1=GND CLKOUT=SCKI1 DIN0=DIN0 DOUT0=DATA GND=GND GPIO_MCU0=GPIO_MCU0 MCLK=CLK1 nRST=nRST1
DSP/DSP2: designators end in _DSP2; ports +3V3=+3V3 +3V3_FLT=+3V3_FLT_DSP2 ADDR0=GND ADDR1=+3V3_FLT_DSP2 CLKOUT=SCKI2 DIN0=DIN0 DOUT0=DATA GND=GND GPIO_MCU0=GPIO_MCU0 MCLK=CLK2 nRST=nRST2

### Layout directives
net class CLK: BCK_IN, BCK_OUT, CLKOUT, DIN0, DOUT0, LRCK_IN, LRCK_OUT, MCLK

### Notes on the sheet
- POW + UP
- Design Note: I2C Address
  A1 - A0 = 00 → 0x70
  A1 - A0 = 01 → 0x72
  A1 - A0 = 10 → 0x74
- OUTPUT

### Library data of the parts
C1-C16 C21-C28 = CAP-SMD
  C1 C6 C8 C14: JLCPart: C324476
  C2-C5 C7 C9-C13: JLCPart: C307331
  C15: JLCPart: C237333
  C16: JLCPart: C513725
  C21-C24: JLCPart: C52923
  C25-C28: JLCPart: C15195
D1 = LED-SMD: JLCPart: C84256
F1 = BLM18PG181SN1D: 90mΩ ±25% 180Ω@100MHz 1.5A - 0603; JLCPart: C82850; Digikey_PN: 490-5263-1-ND
Q1 = FZT953TA: Bipolar (BJT) Transistor PNP 100 V 5 A 120MHz 3 W Surface Mount SOT-223-3; Digikey_PN: FZT953CT-ND; JLCPart: C110507
R1-R7 R9-R11 = RES-SMD
  R1 R11: JLCPart: C22936
  R2 R3: JLCPart: C11702
  R4: JLCPart: C477725
  R5: JLCPart: C25130
  R6 R7 R9 R10: JLCPart: C25744
U1 = ADAU1462WBCPZ300RL: SigmaDSP 294.912 MHz, 32-bit Audio Processor; JLCPart: C654408

## Sheet CLK_Block.SchDoc
size A4; SheetNumber: 11; SheetTotal: 15
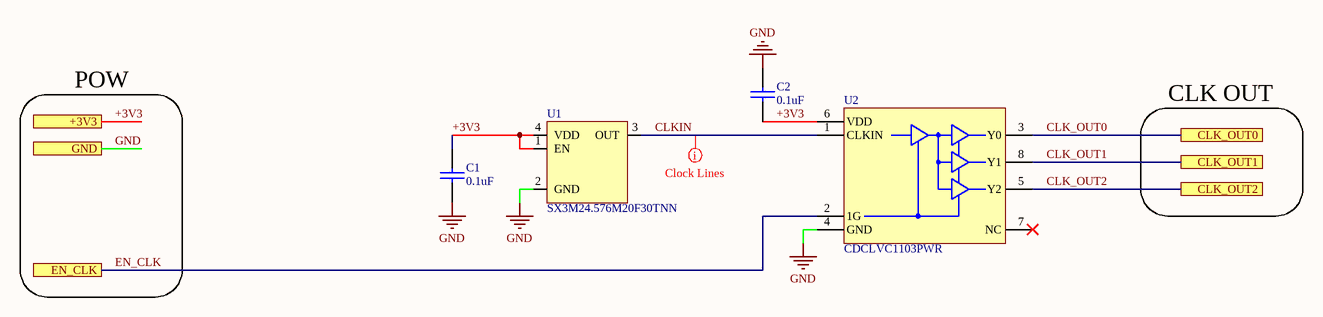
[diagram p5: CLK_Block.SchDoc]

### Parts
(Parts that share a designator on the sheet are numbered #1, #2 ... from top to bottom, then left to right.)
C1#3  0.1uF  [0402-CAP-TDK]
C2#3  0.1uF  [0402-CAP-TDK]
U1#2  SX3M24.576M20F30TNN  [SMD3225]
U2#1  CDCLVC1103PWR  [TI-TSSOP-8-PW0008A]

### Ports
+3V3, CLK_OUT0, CLK_OUT1, CLK_OUT2, EN_CLK, GND

### Nets
+3V3: C1#3.2 C2#3.1 U1#2.1(EN) U1#2.4(VDD) U2#1.6(VDD) ; port +3V3
GND: C1#3.1 C2#3.2 U1#2.2(GND) U2#1.4(GND) ; port GND
CLK_OUT0: U2#1.3(Y0) ; port CLK_OUT0  [project net CLK0]
CLK_OUT1: U2#1.8(Y1) ; port CLK_OUT1  [project net CLK1]
CLK_OUT2: U2#1.5(Y2) ; port CLK_OUT2  [project net CLK2]
CLKIN: U1#2.3(OUT) U2#1.1(CLKIN)
EN_CLK: U2#1.2(1G) ; port EN_CLK  [project net EN_SCK]

Not connected (* = marked no-connect by the designer): U2#1 7(NC)*

### Layout directives
net class CLK: CLKIN

### Notes on the sheet
- POW
- CLK OUT

### Library data of the parts
C1#3 C2#3 = CAP-SMD: JLCPart: C307331
U1#2 = SX3M24.576M20F30TNN: 1.62V-3.63V ±20ppm 24.576MHz SMD3225-4P Oscillators; JLCPart: C2901574
U2#1 = CDCLVC1103PWR: LVCMOS High-Performance Clock Buffer 3-Output; JLCPart: C555453

## Sheet DAC_Interface.SchDoc
size A4; SheetNumber: 8; SheetTotal: 16
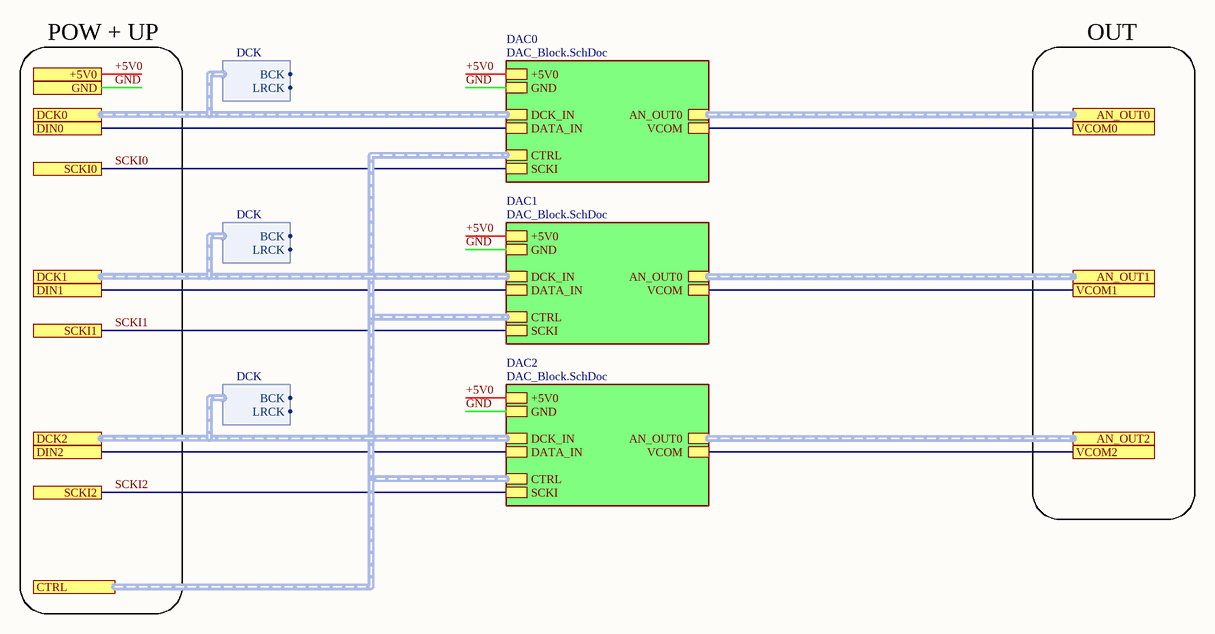
[diagram p6: DAC_Interface.SchDoc]

### Sub-sheets
DAC0 = DAC_Block.SchDoc: GND, +5V0, VCOM, DATA_IN, DCK_IN (harness DCK), SCKI, AN_OUT0 (harness AN), CTRL (harness DAC_CTRL)
DAC1 = DAC_Block.SchDoc: GND, +5V0, VCOM, DATA_IN, DCK_IN (harness DCK), SCKI, AN_OUT0 (harness AN), CTRL (harness DAC_CTRL)
DAC2 = DAC_Block.SchDoc: GND, +5V0, VCOM, DATA_IN, DCK_IN (harness DCK), SCKI, AN_OUT0 (harness AN), CTRL (harness DAC_CTRL)

### Ports
+5V0 (see AudioDSP-v3.1.1_top[5B], DAC_Block[1B], LPF_Block[1B], LPF_Interface[1A], POW_Block[4A]), AN_OUT0 (harness AN, see AudioDSP-v3.1.1_top[6B], DAC_Block[4B]), AN_OUT1 (harness AN, see AudioDSP-v3.1.1_top[6B]), AN_OUT2 (harness AN, see AudioDSP-v3.1.1_top[6C]), CTRL (harness DAC_CTRL, see AudioDSP-v3.1.1_top[6B], DAC_Block[1B]), DCK0 (harness DCK, see AudioDSP-v3.1.1_top[5B]), DCK1 (harness DCK, see AudioDSP-v3.1.1_top[5B]), DCK2 (harness DCK, see AudioDSP-v3.1.1_top[5C]), DIN0 (see AudioDSP-v3.1.1_top[5B]), DIN1 (see AudioDSP-v3.1.1_top[5B]), DIN2 (see AudioDSP-v3.1.1_top[5C]), GND (see AudioDSP-v3.1.1_top[5B], ADC_Block[1B], ADC_Interface[1A], CLK_Block[1B], CTRL_Connectors[1A], DAC_Block[1B], DSP_Block[1A], DSP_Interface[1A], IN_Connectors[3A], LPF_Block[1B], LPF_Interface[1B], MCU_Block[1B], OUT_Connectors[3B], POW_Block[1A], THM_Block[1B]), SCKI0 (see AudioDSP-v3.1.1_top[5C], ADC_Interface[1B]), SCKI1 (see AudioDSP-v3.1.1_top[5C], ADC_Interface[1C]), SCKI2 (see AudioDSP-v3.1.1_top[5C], ADC_Interface[1C]), VCOM0 (see AudioDSP-v3.1.1_top[6B], LPF_Interface[1B]), VCOM1 (see AudioDSP-v3.1.1_top[6B], LPF_Interface[1B]), VCOM2 (see AudioDSP-v3.1.1_top[6C], LPF_Interface[1C])

### Harnesses
DCK: BCK, LRCK

### Nets
+5V0: port +5V0, sheet DAC0/+5V0, sheet DAC1/+5V0, sheet DAC2/+5V0
GND: port GND, sheet DAC0/GND, sheet DAC1/GND, sheet DAC2/GND
DATA: port DIN0, sheet DAC0/DATA_IN
DATA: port DIN1, sheet DAC1/DATA_IN  [a separate net that carries the same name]
DATA: port DIN2, sheet DAC2/DATA_IN  [a separate net that carries the same name]
SCKI0: port SCKI0, sheet DAC0/SCKI
SCKI1: port SCKI1, sheet DAC1/SCKI
SCKI2: port SCKI2, sheet DAC2/SCKI
VCOM: port VCOM0, sheet DAC0/VCOM
VCOM: port VCOM1, sheet DAC1/VCOM  [a separate net that carries the same name]
VCOM: port VCOM2, sheet DAC2/VCOM  [a separate net that carries the same name]

### Buses and harness runs
harness port AN_OUT0 = sheet DAC0/AN_OUT0
harness port AN_OUT1 = sheet DAC1/AN_OUT0
harness port AN_OUT2 = sheet DAC2/AN_OUT0
harness port CTRL = sheet DAC0/CTRL = sheet DAC1/CTRL = sheet DAC2/CTRL
harness port DCK0 = sheet DAC0/DCK_IN
harness port DCK1 = sheet DAC1/DCK_IN
harness port DCK2 = sheet DAC2/DCK_IN

### Notes on the sheet
- POW + UP
- OUT

## Sheet DAC_Block.SchDoc
size A4; SheetNumber: 10; SheetTotal: 16
Used 3 times, as channels DAC/DAC0, DAC/DAC1, DAC/DAC2. Parts and nets are listed once, with the designators drawn on the sheet.
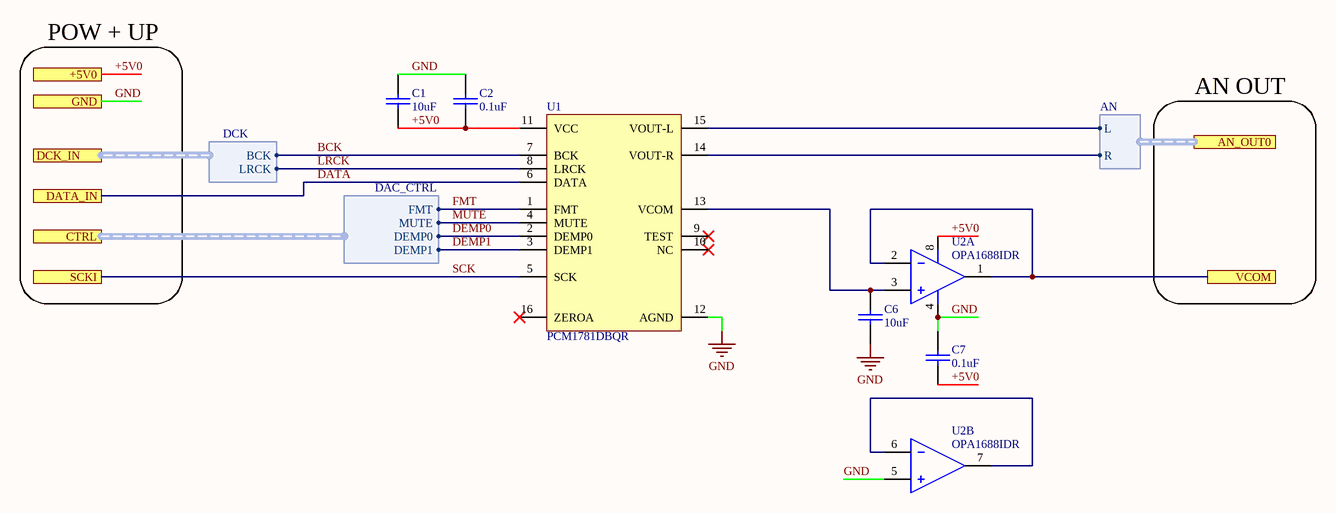
[diagram p7: DAC_Block.SchDoc]

### Parts
C1  10uF  [0603-CAP-TDK]
C2  0.1uF  [0402-CAP-TDK]
C6  10uF  [0603-CAP-TDK]
C7  0.1uF  [0402-CAP-TDK]
U1  PCM1781DBQR  [TI-SSOP-16 - DBQ0016A]
U2  OPA1688IDR  [TI-SOIC-8]  (parts A,B of 2)

### Ports
+5V0 (see DAC_Interface[2A], DAC_Interface[1A]), AN_OUT0 (harness AN, see DAC_Interface[3B], DAC_Interface[4B]), CTRL (harness DAC_CTRL, see DAC_Interface[2B], DAC_Interface[1C]), DATA_IN (see DAC_Interface[2B]), DCK_IN (harness DCK, see DAC_Interface[2B]), GND (see DAC_Interface[2B], DAC_Interface[1B]), SCKI (see DAC_Interface[2B]), VCOM (see DAC_Interface[3B])

### Harnesses
DCK: BCK, LRCK
AN: L, R
DAC_CTRL: FMT, MUTE, DEMP0, DEMP1

### Nets
GND: C1.1 C2.1 C6.1 C7.2 U1.12(AGND) U2.4(GND) U2.5(2IN+) ; port GND
+5V0: C1.2 C2.2 C7.1 U1.11(VCC) U2.8(VDD) ; port +5V0
BCK: U1.7(BCK) ; port DCK_IN.BCK
DATA: U1.6(DATA) ; port DATA_IN
DEMP0: U1.2(DEMP0) ; port CTRL.DEMP0
DEMP1: U1.3(DEMP1) ; port CTRL.DEMP1
FMT: U1.1(FMT) ; port CTRL.FMT
LRCK: U1.8(LRCK) ; port DCK_IN.LRCK
MUTE: U1.4(MUTE) ; port CTRL.MUTE
SCK: U1.5(SCK) ; port SCKI
VCOM: U2.1(1OUT) U2.2(1IN-) ; port VCOM
NetC6_2: C6.2 U1.13(VCOM) U2.3(1IN+)
NetU1_14: U1.14(VOUT-R) ; port AN_OUT0.R
NetU1_15: U1.15(VOUT-L) ; port AN_OUT0.L
NetU2_6: U2.6(2IN-) U2.7(2OUT)

Not connected (* = marked no-connect by the designer): U1 9(TEST)* 10(NC)* 16(ZEROA)*

### Channels
DAC/DAC0: designators end in _DAC0; ports +5V0=+5V0 DATA_IN=DATA GND=GND SCKI=SCKI0 VCOM=VCOM
DAC/DAC1: designators end in _DAC1; ports +5V0=+5V0 DATA_IN=DATA GND=GND SCKI=SCKI1 VCOM=VCOM
DAC/DAC2: designators end in _DAC2; ports +5V0=+5V0 DATA_IN=DATA GND=GND SCKI=SCKI2 VCOM=VCOM

### Notes on the sheet
- POW + UP
- AN OUT

### Library data of the parts
C1 C2 C6 C7 = CAP-SMD
  C1 C6: JLCPart: C96446
  C2 C7: JLCPart: C307331
U1 = PCM1781DBQR: DAC, Audio 24 b 192k DSP, I2S 16-SSOP; JLCPart: C2667281
U2 = OPA1688IDR: Rail-To-Rail Amplifier 2 Circuit - 8-SOIC; JLCPart: C206212

## Sheet IN_Connectors.SchDoc
size A4; SheetNumber: 14; SheetTotal: 15
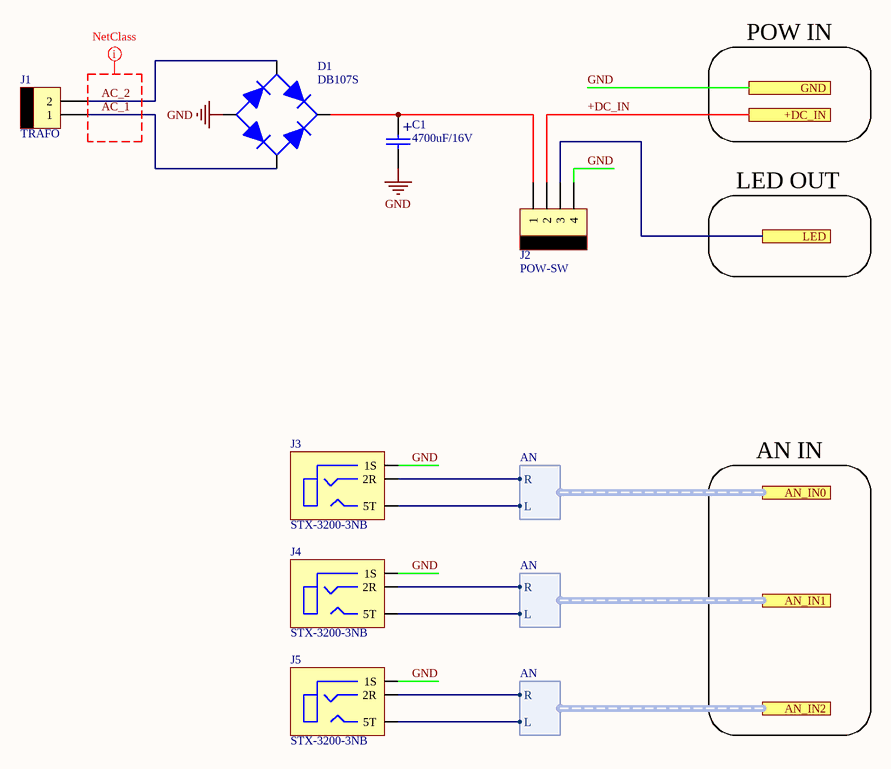
[diagram p8: IN_Connectors.SchDoc]

### Parts
(Parts that share a designator on the sheet are numbered #1, #2 ... from top to bottom, then left to right.)
C1#4  4700uF/16V  [CAP200RP]
D1#1  DB107S  [DBS]
J1  TRAFO  [MOLEX-2]
J2  POW-SW  [MOLEX-4]
J3  STX-3200-3NB  [JACK-3.5-3POS]
J4  STX-3200-3NB  [JACK-3.5-3POS]
J5  STX-3200-3NB  [JACK-3.5-3POS]

### Ports
+DC_IN, AN_IN0 (harness AN), AN_IN1 (harness AN), AN_IN2 (harness AN), GND, LED

### Harnesses
AN: L, R

### Nets
GND: C1#4.2 D1#1.4(-) J2.4 J3.1S J4.1S J5.1S ; port GND
+DC_IN: J2.2 ; port +DC_IN
AC_1: D1#1.3(AC-) J1.1
AC_2: D1#1.1(AC+) J1.2
AN_IN0.L: J3.5T ; port AN_IN0.L
AN_IN0.R: J3.2R ; port AN_IN0.R
AN_IN1.L: J4.5T ; port AN_IN1.L
AN_IN1.R: J4.2R ; port AN_IN1.R
AN_IN2.L: J5.5T ; port AN_IN2.L
AN_IN2.R: J5.2R ; port AN_IN2.R
NetC1#4_1: C1#4.1 D1#1.2(+) J2.1
NetJ2_3: J2.3 ; port LED

### Layout directives
net class AC_IN: AC_1, AC_2

### Notes on the sheet
- POW IN
- LED OUT
- AN IN
- (in symbol CAPPOL-THT) +

### Library data of the parts
C1#4 = CAPPOL-THT
D1#1 = DB107S: Bridge Rectifier Single Phase Standard 1000 V Surface Mount 4-MiniDIP; JLCPart: C5377
J1 = MOLEX-2
J2 = MOLEX-4

## Sheet ADC_Interface.SchDoc
size A4; SheetNumber: 6; SheetTotal: 16
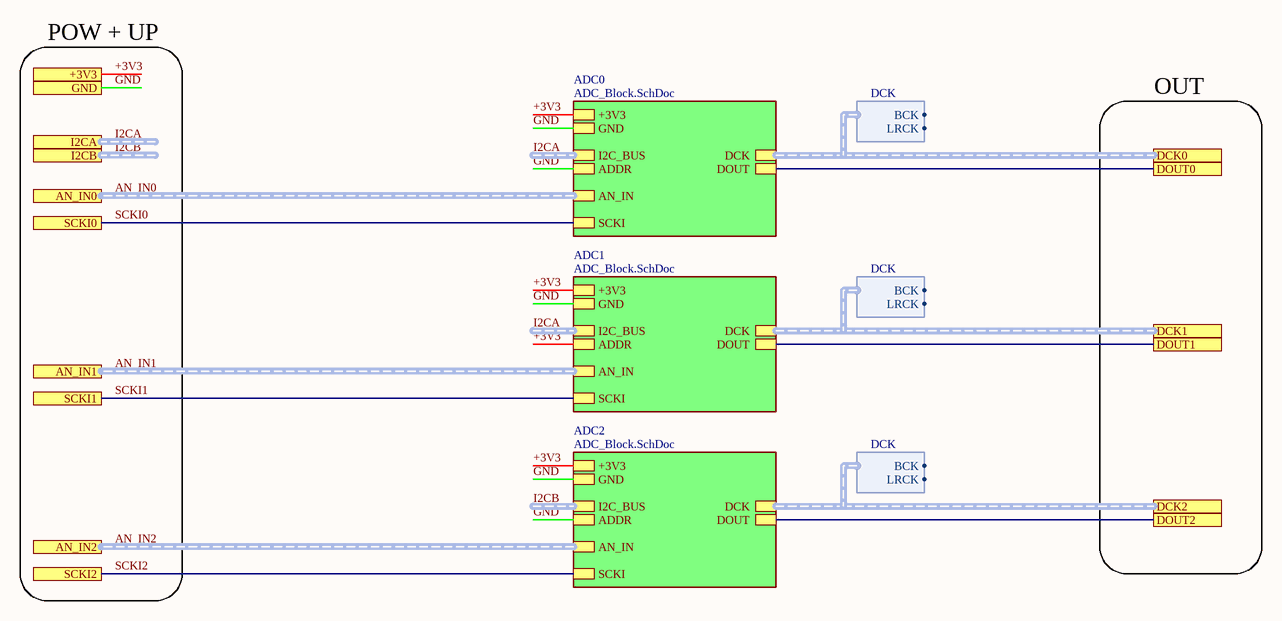
[diagram p9: ADC_Interface.SchDoc]

### Sub-sheets
ADC0 = ADC_Block.SchDoc: +3V3, GND, I2C_BUS (harness I2C), AN_IN (harness AN), SCKI, DCK (harness DCK), DOUT, ADDR
ADC1 = ADC_Block.SchDoc: +3V3, GND, I2C_BUS (harness I2C), AN_IN (harness AN), SCKI, DCK (harness DCK), DOUT, ADDR
ADC2 = ADC_Block.SchDoc: +3V3, GND, I2C_BUS (harness I2C), AN_IN (harness AN), SCKI, DCK (harness DCK), DOUT, ADDR

### Ports
+3V3 (see AudioDSP-v3.1.1_top[2B], ADC_Block[1A], CLK_Block[1B], CTRL_Connectors[1A], DSP_Block[1A], DSP_Interface[1A], MCU_Block[1A], POW_Block[4B], THM_Block[1B]), AN_IN0 (harness AN, see AudioDSP-v3.1.1_top[2B], IN_Connectors[3C]), AN_IN1 (harness AN, see AudioDSP-v3.1.1_top[2B], IN_Connectors[3C]), AN_IN2 (harness AN, see AudioDSP-v3.1.1_top[2B], IN_Connectors[3C]), DCK0 (harness DCK, see AudioDSP-v3.1.1_top[3B]), DCK1 (harness DCK, see AudioDSP-v3.1.1_top[3B]), DCK2 (harness DCK, see AudioDSP-v3.1.1_top[3C]), DOUT0 (see AudioDSP-v3.1.1_top[3B]), DOUT1 (see AudioDSP-v3.1.1_top[3B]), DOUT2 (see AudioDSP-v3.1.1_top[3C]), GND (see AudioDSP-v3.1.1_top[2B], ADC_Block[1B], CLK_Block[1B], CTRL_Connectors[1A], DAC_Block[1B], DAC_Interface[1B], DSP_Block[1A], DSP_Interface[1A], IN_Connectors[3A], LPF_Block[1B], LPF_Interface[1B], MCU_Block[1B], OUT_Connectors[3B], POW_Block[1A], THM_Block[1B]), I2CA (harness I2C, see AudioDSP-v3.1.1_top[2B]), I2CB (harness I2C, see AudioDSP-v3.1.1_top[2B]), SCKI0 (see AudioDSP-v3.1.1_top[3C], DAC_Interface[1B]), SCKI1 (see AudioDSP-v3.1.1_top[3C], DAC_Interface[1B]), SCKI2 (see AudioDSP-v3.1.1_top[3C], DAC_Interface[1C])

### Harnesses
DCK: BCK, LRCK

### Nets
+3V3: port +3V3, sheet ADC0/+3V3, sheet ADC1/+3V3, sheet ADC1/ADDR, sheet ADC2/+3V3
GND: port GND, sheet ADC0/GND, sheet ADC0/ADDR, sheet ADC1/GND, sheet ADC2/GND, sheet ADC2/ADDR
DIN0: port DOUT0, sheet ADC0/DOUT
DIN0: port DOUT1, sheet ADC1/DOUT  [a separate net that carries the same name]
DIN0: port DOUT2, sheet ADC2/DOUT  [a separate net that carries the same name]
SCKI0: port SCKI0, sheet ADC0/SCKI
SCKI1: port SCKI1, sheet ADC1/SCKI
SCKI2: port SCKI2, sheet ADC2/SCKI

### Buses and harness runs
harness AN_IN0 = port AN_IN0 = sheet ADC0/AN_IN
harness AN_IN1 = port AN_IN1 = sheet ADC1/AN_IN
harness AN_IN2 = port AN_IN2 = sheet ADC2/AN_IN
harness I2CA = port I2CA
harness I2CA = sheet ADC0/I2C_BUS
harness I2CA = sheet ADC1/I2C_BUS
harness I2CB = port I2CB
harness I2CB = sheet ADC2/I2C_BUS
harness port DCK0 = sheet ADC0/DCK
harness port DCK1 = sheet ADC1/DCK
harness port DCK2 = sheet ADC2/DCK

### Notes on the sheet
- POW + UP
- OUT

## Sheet ADC_Block.SchDoc
size A4; SheetNumber: 7; SheetTotal: 16
Used 3 times, as channels ADC/ADC0, ADC/ADC1, ADC/ADC2. Parts and nets are listed once, with the designators drawn on the sheet.
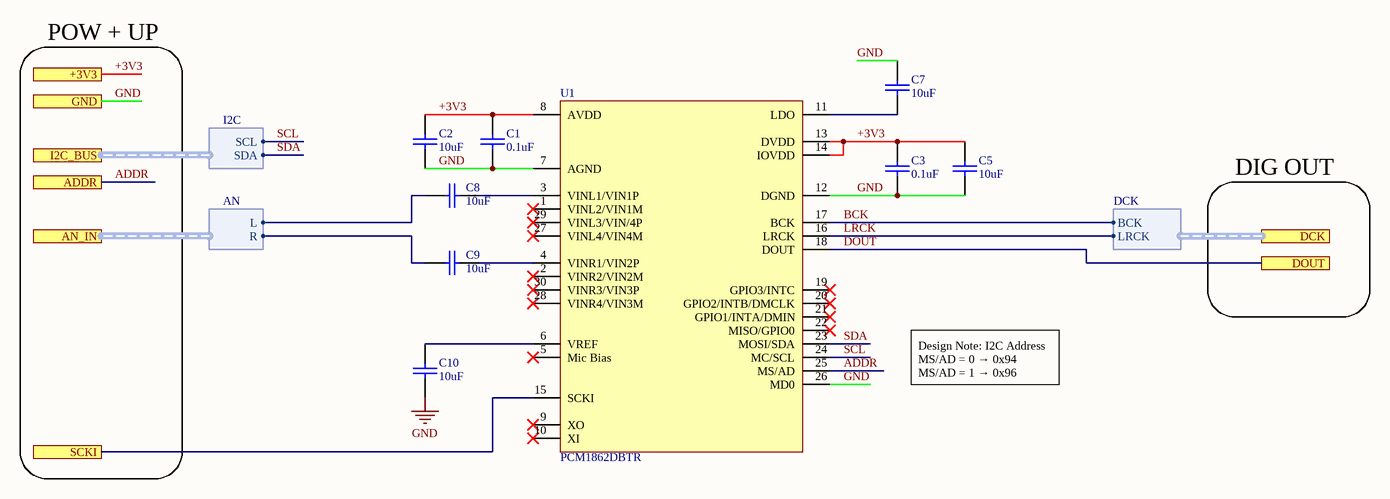
[diagram p10: ADC_Block.SchDoc]

### Parts
C1  0.1uF  [0402-CAP-TDK]
C2  10uF  [0603-CAP-TDK]
C3  0.1uF  [0402-CAP-TDK]
C5  10uF  [0603-CAP-TDK]
C7  10uF  [0603-CAP-TDK]
C8  10uF  [0603-CAP-TDK]
C9  10uF  [0603-CAP-TDK]
C10  10uF  [0603-CAP-TDK]
U1  PCM1862DBTR  [TI-TSSOP-30-DBT0030A]

### Ports
+3V3 (see ADC_Interface[2A], ADC_Interface[1A], CLK_Block[1B], CTRL_Connectors[1A], DSP_Block[1A], DSP_Interface[1A], MCU_Block[1A], POW_Block[4B], THM_Block[1B]), ADDR (see ADC_Interface[2B]), AN_IN (harness AN, see ADC_Interface[2B]), DCK (harness DCK, see ADC_Interface[3B]), DOUT (see ADC_Interface[3B]), GND (see ADC_Interface[2A], ADC_Interface[1A], CLK_Block[1B], CTRL_Connectors[1A], DAC_Block[1B], DAC_Interface[1B], DSP_Block[1A], DSP_Interface[1A], IN_Connectors[3A], LPF_Block[1B], LPF_Interface[1B], MCU_Block[1B], OUT_Connectors[3B], POW_Block[1A], THM_Block[1B]), I2C_BUS (harness I2C, see ADC_Interface[2B]), SCKI (see ADC_Interface[2B], DAC_Block[1C])

### Harnesses
I2C: SCL, SDA
AN: L, R
DCK: BCK, LRCK

### Nets
GND: C1.1 C2.1 C3.1 C5.1 C7.2 C10.1 U1.7(AGND) U1.12(DGND) U1.26(MD0) ; port GND
+3V3: C1.2 C2.2 C3.2 C5.2 U1.8(AVDD) U1.13(DVDD) U1.14(IOVDD) ; port +3V3
ADDR: U1.25(MS/AD) ; port ADDR
BCK: U1.17(BCK) ; port DCK.BCK
DOUT: U1.18(DOUT) ; port DOUT
LRCK: U1.16(LRCK) ; port DCK.LRCK
SCKI: U1.15(SCKI) ; port SCKI
SCL: U1.24(MC/SCL) ; port I2C_BUS.SCL
SDA: U1.23(MOSI/SDA) ; port I2C_BUS.SDA
NetC7_1: C7.1 U1.11(LDO)
NetC8_1: C8.1 U1.3(VINL1/VIN1P)
NetC8_2: C8.2 ; port AN_IN.L
NetC9_1: C9.1 U1.4(VINR1/VIN2P)
NetC9_2: C9.2 ; port AN_IN.R
NetC10_2: C10.2 U1.6(VREF)

Not connected (* = marked no-connect by the designer): U1 1(VINL2/VIN1M)* 2(VINR2/VIN2M)* 5(Mic_Bias)* 9(XO)* 10(XI)* 19(GPIO3/INTC)* 20(GPIO2/INTB/DMCLK)* 21(GPIO1/INTA/DMIN)* 22(MISO/GPIO0)* 27(VINL4/VIN4M)* 28(VINR4/VIN3M)* 29(VINL3/VIN/4P)* 30(VINR3/VIN3P)*

### Channels
ADC/ADC0: designators end in _ADC0; ports +3V3=+3V3 ADDR=GND DOUT=DIN0 GND=GND SCKI=SCKI0
ADC/ADC1: designators end in _ADC1; ports +3V3=+3V3 ADDR=+3V3 DOUT=DIN0 GND=GND SCKI=SCKI1
ADC/ADC2: designators end in _ADC2; ports +3V3=+3V3 ADDR=GND DOUT=DIN0 GND=GND SCKI=SCKI2

### Notes on the sheet
- POW + UP
- DIG OUT
- Design Note: I2C Address
  MS/AD = 0 → 0x94
  MS/AD = 1 → 0x96

### Library data of the parts
C1-C3 C5 C7-C10 = CAP-SMD
  C1 C3: JLCPart: C307331
  C2 C5 C7-C10: JLCPart: C96446
U1 = PCM1862DBTR: JLCPart: C544647

## Sheet LPF_Interface.SchDoc
size A4; SheetNumber: 15; SheetTotal: 16
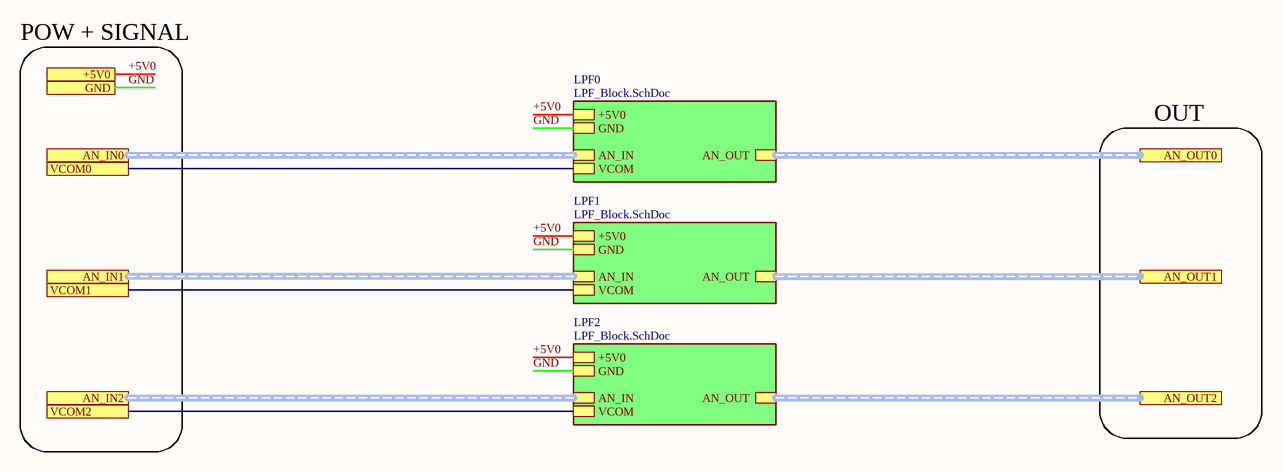
[diagram p11: LPF_Interface.SchDoc]

### Sub-sheets
LPF0 = LPF_Block.SchDoc: GND, +5V0, VCOM, AN_IN (harness AN), AN_OUT (harness AN)
LPF1 = LPF_Block.SchDoc: GND, +5V0, VCOM, AN_IN (harness AN), AN_OUT (harness AN)
LPF2 = LPF_Block.SchDoc: GND, +5V0, VCOM, AN_IN (harness AN), AN_OUT (harness AN)

### Ports
+5V0 (see AudioDSP-v3.1.1_top[7B], LPF_Block[1B]), AN_IN0 (harness AN, see AudioDSP-v3.1.1_top[7B]), AN_IN1 (harness AN, see AudioDSP-v3.1.1_top[7B]), AN_IN2 (harness AN, see AudioDSP-v3.1.1_top[7B]), AN_OUT0 (harness AN, see AudioDSP-v3.1.1_top[7B]), AN_OUT1 (harness AN, see AudioDSP-v3.1.1_top[7B]), AN_OUT2 (harness AN, see AudioDSP-v3.1.1_top[7B]), GND (see AudioDSP-v3.1.1_top[7B], LPF_Block[1B]), VCOM0 (see AudioDSP-v3.1.1_top[7B]), VCOM1 (see AudioDSP-v3.1.1_top[7B]), VCOM2 (see AudioDSP-v3.1.1_top[7B])

### Nets
+5V0: port +5V0, sheet LPF0/+5V0, sheet LPF1/+5V0, sheet LPF2/+5V0
GND: port GND, sheet LPF0/GND, sheet LPF1/GND, sheet LPF2/GND
VCOM: port VCOM0, sheet LPF0/VCOM
VCOM: port VCOM1, sheet LPF1/VCOM  [a separate net that carries the same name]
VCOM: port VCOM2, sheet LPF2/VCOM  [a separate net that carries the same name]

### Buses and harness runs
harness port AN_IN0 = sheet LPF0/AN_IN
harness port AN_IN1 = sheet LPF1/AN_IN
harness port AN_IN2 = sheet LPF2/AN_IN
harness port AN_OUT0 = sheet LPF0/AN_OUT
harness port AN_OUT1 = sheet LPF1/AN_OUT
harness port AN_OUT2 = sheet LPF2/AN_OUT

### Notes on the sheet
- POW + SIGNAL
- OUT

## Sheet LPF_Block.SchDoc
size A4; SheetNumber: 12; SheetTotal: 13
Used 3 times, as channels LPF/LPF0, LPF/LPF1, LPF/LPF2. Parts and nets are listed once, with the designators drawn on the sheet.
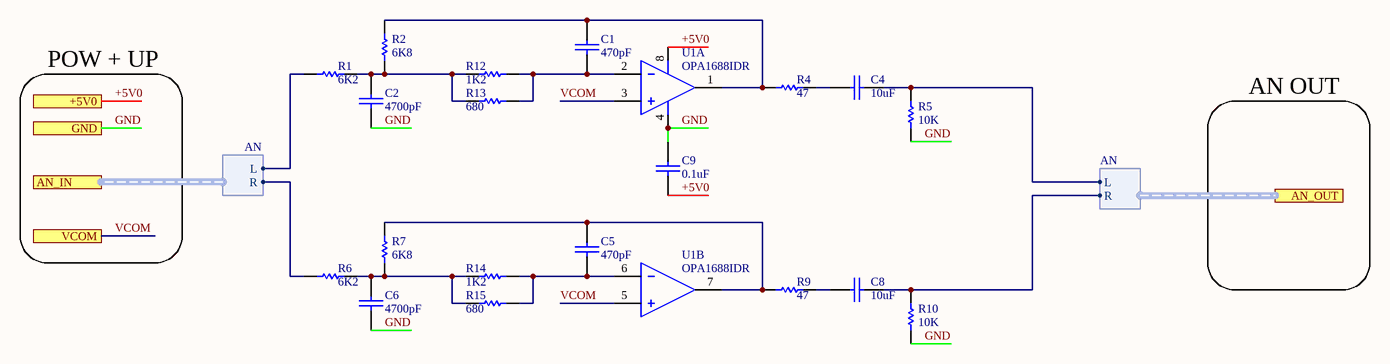
[diagram p12: LPF_Block.SchDoc]

### Parts
C1  470pF  [0402-CAP-TDK]
C2  4700pF  [0402-CAP-TDK]
C4  10uF  [0603-CAP-TDK]
C5  470pF  [0402-CAP-TDK]
C6  4700pF  [0402-CAP-TDK]
C8  10uF  [0603-CAP-TDK]
C9  0.1uF  [0402-CAP-TDK]
R1  6K2  [0603-RES-PANASONIC]
R2  6K8  [0402-RES-PANASONIC]
R4  47  [0402-RES-PANASONIC]
R5  10K  [0402-RES-PANASONIC]
R6  6K2  [0603-RES-PANASONIC]
R7  6K8  [0402-RES-PANASONIC]
R9  47  [0402-RES-PANASONIC]
R10  10K  [0402-RES-PANASONIC]
R12  1K2  [0402-RES-PANASONIC]
R13  680  [0402-RES-PANASONIC]
R14  1K2  [0402-RES-PANASONIC]
R15  680  [0402-RES-PANASONIC]
U1  OPA1688IDR  [TI-SOIC-8]  (parts A,B of 2)

### Ports
+5V0 (see LPF_Interface[2B], DAC_Block[1B], LPF_Interface[1B], POW_Block[4B]), AN_IN (harness AN, see LPF_Interface[2B]), AN_OUT (harness AN, see LPF_Interface[3B]), GND (see LPF_Interface[2B], ADC_Block[1B], ADC_Interface[1B], CTRL_Connectors[1A], DAC_Block[1B], DSP_Block[1A], IN_Connectors[3A], LPF_Interface[1B], MCU_Block[1B], OUT_Connectors[3B], PLL_Block[1A], POW_Block[1B]), VCOM (see LPF_Interface[2B], DAC_Block[4C], LPF_Interface[1B])

### Harnesses
AN: L, R

### Nets
+5V0: C9.1 U1.8(VDD) ; port +5V0
GND: C2.1 C6.1 C9.2 R5.1 R10.1 U1.4(GND) ; port GND
VCOM: U1.3(1IN+) U1.5(2IN+) ; port VCOM
NetC1_1: C1.1 R12.2 R13.2 U1.2(1IN-)
NetC1_2: C1.2 R2.2 R4.2 U1.1(1OUT)
NetC2_2: C2.2 R1.1 R2.1 R12.1 R13.1
NetC4_1: C4.1 R5.2 ; port AN_OUT.L
NetC4_2: C4.2 R4.1
NetC5_1: C5.1 R14.2 R15.2 U1.6(2IN-)
NetC5_2: C5.2 R7.2 R9.2 U1.7(2OUT)
NetC6_2: C6.2 R6.1 R7.1 R14.1 R15.1
NetC8_1: C8.1 R10.2 ; port AN_OUT.R
NetC8_2: C8.2 R9.1
NetR1_2: R1.2 ; port AN_IN.L
NetR6_2: R6.2 ; port AN_IN.R

### Channels
LPF/LPF0: designators end in _LPF0; ports +5V0=+5V0 GND=GND VCOM=VCOM
LPF/LPF1: designators end in _LPF1; ports +5V0=+5V0 GND=GND VCOM=VCOM
LPF/LPF2: designators end in _LPF2; ports +5V0=+5V0 GND=GND VCOM=VCOM

### Notes on the sheet
- POW + UP
- AN OUT

### Library data of the parts
C1 C2 C4-C6 C8 C9 = CAP-SMD
  C1 C5: JLCPart: C1537
  C2 C6: JLCPart: C1538
  C4 C8: JLCPart: C96446
  C9: JLCPart: C307331
R1 R2 R4-R7 R9 R10 R12-R15 = RES-SMD
  R1 R6: JLCPart: C4260
  R2 R7: JLCPart: C25917
  R4 R9: JLCPart: C25118
  R5 R10: JLCPart: C25744
  R12 R14: JLCPart: C25862
  R13 R15: JLCPart: C25130
U1 = OPA1688IDR: as U2 on sheet DAC_Block; JLCPart: C206212

## Sheet OUT_Connectors.SchDoc
size A4; SheetNumber: 15; SheetTotal: 15
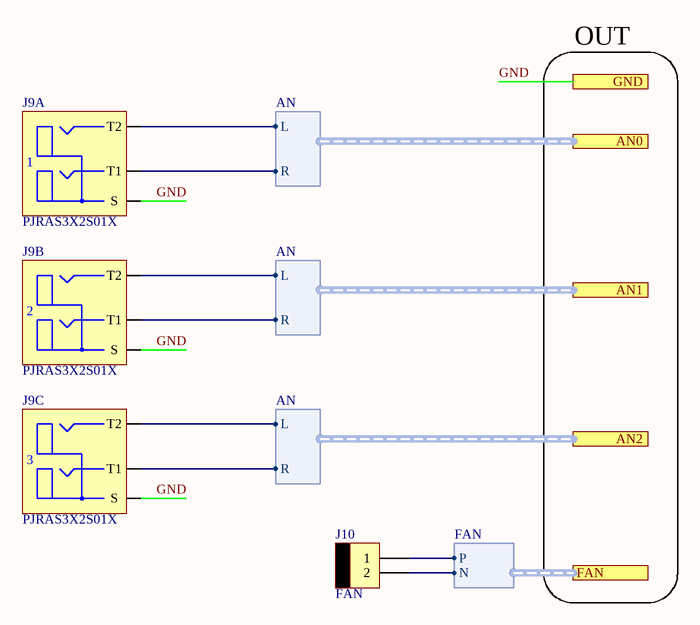
[diagram p13: OUT_Connectors.SchDoc]

### Parts
J9  PJRAS3X2S01X  [RCA2X3-RA]  (parts A,B,C of 3)
J10  FAN  [MOLEX-2]

### Ports
AN0 (harness AN), AN1 (harness AN), AN2 (harness AN), FAN (harness FAN), GND

### Harnesses
AN: L, R
FAN: P, N

### Nets
GND: J9.S1(S) J9.S2(S) J9.S3(S) J10.2 ; port GND, port FAN.N
+5V0_FAN: J10.1 ; port FAN.P
NetC4_LPF0_1: J9.T2-1(T2) ; port AN0.L
NetC4_LPF1_1: J9.T2-2(T2) ; port AN1.L
NetC4_LPF2_1: J9.T2-3(T2) ; port AN2.L
NetC8_LPF0_1: J9.T1-1(T1) ; port AN0.R
NetC8_LPF1_1: J9.T1-2(T1) ; port AN1.R
NetC8_LPF2_1: J9.T1-3(T1) ; port AN2.R

### Notes on the sheet
- OUT
- (in symbol PJRAS3X2S01X, part A) 1
- (in symbol PJRAS3X2S01X, part B) 2
- (in symbol PJRAS3X2S01X, part C) 3

### Library data of the parts
J9 = PJRAS3X2S01X: 3.20mm ID, 9.00mm OD (RCA) Phono (RCA) Jack Mono Connector Solder; Digikey_PN: SC1860-ND
J10 = MOLEX-2

## Sheet POW_Block.SchDoc
size A4; SheetNumber: 2; SheetTotal: 15
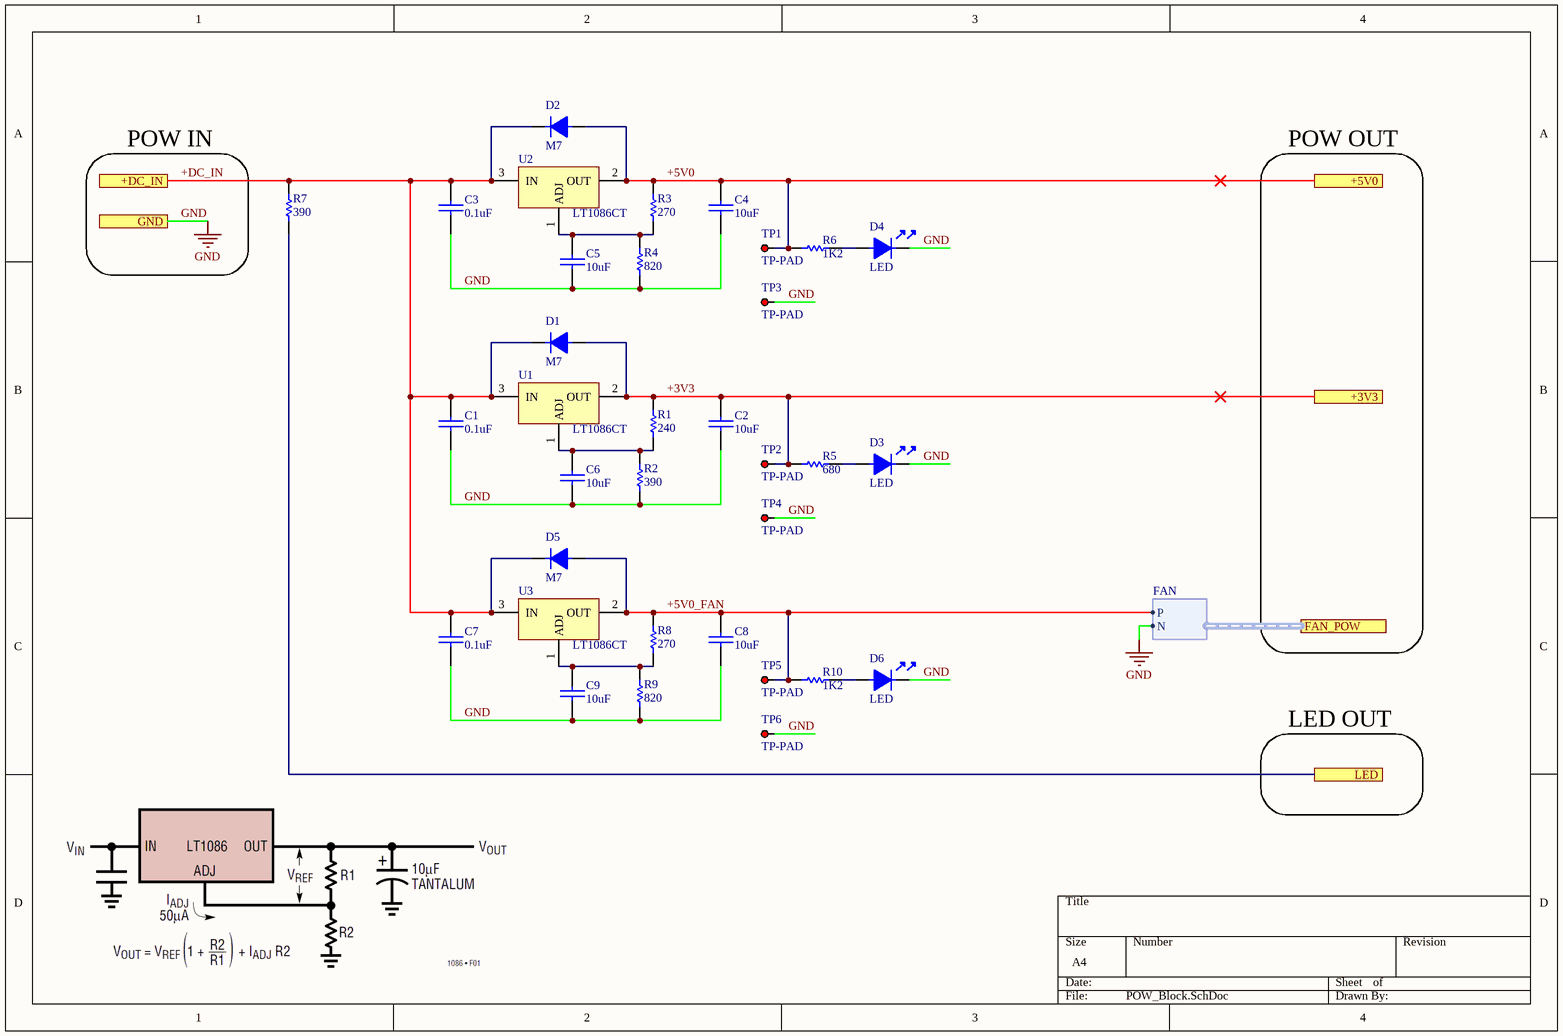
[diagram p14: POW_Block.SchDoc]

### Parts
(Parts that share a designator on the sheet are numbered #1, #2 ... from top to bottom, then left to right.)
C1#5  0.1uF  [0402-CAP-TDK]
C2#4  10uF  [0603-CAP-TDK]
C3#3  0.1uF  [0402-CAP-TDK]
C4#3  10uF  [0603-CAP-TDK]
C5#3  10uF  [0603-CAP-TDK]
C6#3  10uF  [0603-CAP-TDK]
C7#3  0.1uF  [0402-CAP-TDK]
C8#3  10uF  [0603-CAP-TDK]
C9#3  10uF  [0603-CAP-TDK]
D1#2  M7  [DO-214AC-SMA]
D2  M7  [DO-214AC-SMA]
D3  LED  [LED-0805]
D4  LED  [LED-0805]
D5  M7  [DO-214AC-SMA]
D6  LED  [LED-0805]
R1#3  240  [0805-RES-PANASONIC]
R2#3  390  [0805-RES-PANASONIC]
R3#3  270  [0805-RES-PANASONIC]
R4#3  820  [0805-RES-PANASONIC]
R5#3  680  [0402-RES-PANASONIC]
R6#3  1K2  [0402-RES-PANASONIC]
R7#2  390  [0805-RES-PANASONIC]
R8#2  270  [0805-RES-PANASONIC]
R9#2  820  [0805-RES-PANASONIC]
R10#2  1K2  [0402-RES-PANASONIC]
TP1  TP-PAD  [TPTH - PAD TOP]  (no BOM)
TP2  TP-PAD  [TPTH - PAD TOP]  (no BOM)
TP3  TP-PAD  [TPTH - PAD TOP]  (no BOM)
TP4  TP-PAD  [TPTH - PAD TOP]  (no BOM)
TP5  TP-PAD  [TPTH - PAD TOP]  (no BOM)
TP6  TP-PAD  [TPTH - PAD TOP]  (no BOM)
U1#3  LT1086CT  [TO-220 - KCS0003B]
U2#2  LT1086CT  [TO-220 - KCS0003B]
U3  LT1086CT  [TO-220 - KCS0003B]

### Ports
+3V3, +5V0, +DC_IN, FAN_POW (harness FAN), GND, LED

### Harnesses
FAN: P, N

### Nets
+3V3: C2#4.2 D1#2.1 R1#3.2 R5#3.1 TP2.1 U1#3.2(OUT) ; port +3V3
+5V0: C4#3.2 D2.1 R3#3.2 R6#3.1 TP1.1 U2#2.2(OUT) ; port +5V0
GND: C1#5.1 C2#4.1 C3#3.1 C4#3.1 C5#3.1 C6#3.1 C7#3.1 C8#3.1 C9#3.1 D3.2 D4.2 D6.2 R2#3.1 R4#3.1 R9#2.1 TP3.1 TP4.1 TP6.1 ; port GND, port FAN_POW.N
+5V0_FAN: C8#3.2 D5.1 R8#2.2 R10#2.1 TP5.1 U3.2(OUT) ; port FAN_POW.P
+DC_IN: C1#5.2 C3#3.2 C7#3.2 D1#2.2 D2.2 D5.2 R7#2.2 U1#3.3(IN) U2#2.3(IN) U3.3(IN) ; port +DC_IN
NetC5#3_2: C5#3.2 R3#3.1 R4#3.2 U2#2.1(ADJ)
NetC6#3_2: C6#3.2 R1#3.1 R2#3.2 U1#3.1(ADJ)
NetC9#3_2: C9#3.2 R8#2.1 R9#2.2 U3.1(ADJ)
NetD3_1: D3.1 R5#3.2
NetD4_1: D4.1 R6#3.2
NetD6_1: D6.1 R10#2.2
NetJ2_3: R7#2.1 ; port LED

### Notes on the sheet
- POW IN
- POW OUT
- LED OUT

### Library data of the parts
C1#5 C2#4 C3#3 C4#3 C5#3 C6#3 C7#3 C8#3 C9#3 = CAP-SMD
  C1#5 C3#3 C7#3: JLCPart: C307331
  C2#4 C4#3 C5#3 C6#3 C8#3 C9#3: JLCPart: C96446
D1#2 D2 D5 = M7: Diode Rectifier 1A 1kV; JLCPart: C95872
D3 D4 D6 = LED-SMD: JLCPart: C84256
R1#3 R2#3 R3#3 R4#3 R5#3 R6#3 R7#2 R8#2 R9#2 R10#2 = RES-SMD
  R1#3: JLCPart: C17572
  R2#3 R7#2: JLCPart: C17655
  R3#3 R8#2: JLCPart: C17590
  R4#3 R9#2: JLCPart: C17837
  R5#3: JLCPart: C25130
  R6#3 R10#2: JLCPart: C25862

## Nets that join several sheets
+3V3: CTRL_Connectors (J6.14 J7.14 J8.1), MCU_Block (18 pins), DSP/DSP0 (F1_DSP0.2), DSP/DSP1 (F1_DSP1.2), DSP/DSP2 (F1_DSP2.2), CLK_Block (5 pins), ADC/ADC0 (7 pins), ADC/ADC1 (8 pins), ADC/ADC2 (7 pins), POW_Block (6 pins)
+5V0: DAC/DAC0 (5 pins), DAC/DAC1 (5 pins), DAC/DAC2 (5 pins), LPF/LPF0 (C9_LPF0.1 U1_LPF0.8), LPF/LPF1 (C9_LPF1.1 U1_LPF1.8), LPF/LPF2 (C9_LPF2.1 U1_LPF2.8), POW_Block (6 pins)
GND: CTRL_Connectors (23 pins), MCU_Block (14 pins), DSP/DSP0 (38 pins), DSP/DSP1 (37 pins), DSP/DSP2 (37 pins), CLK_Block (C1#3.1 C2#3.2 U1#2.2 U2#1.4), DAC/DAC0 (7 pins), DAC/DAC1 (7 pins), DAC/DAC2 (7 pins), IN_Connectors (6 pins), ADC/ADC0 (10 pins), ADC/ADC1 (9 pins), ADC/ADC2 (10 pins), LPF/LPF0 (6 pins), LPF/LPF1 (6 pins), LPF/LPF2 (6 pins), OUT_Connectors (J9.S1 J9.S2 J9.S3 J10.2), POW_Block (18 pins)
+5V0_FAN: OUT_Connectors (J10.1), POW_Block (6 pins)
+DC_IN: IN_Connectors (J2.2), POW_Block (10 pins)
ADC0: CTRL_Connectors (C1#1.2 R1#1.2), MCU_Block (U1#1.14)
ADC1: CTRL_Connectors (C2#1.2 R2#1.2), MCU_Block (U1#1.15)
ADC2: CTRL_Connectors (C3#1.2 R3#1.2), MCU_Block (U1#1.16)
ADC3: CTRL_Connectors (C4#1.2 R4#1.2), MCU_Block (U1#1.17)
ADC4: CTRL_Connectors (C5#1.2 R5#1.2), MCU_Block (U1#1.20)
ADC5: CTRL_Connectors (C6#1.2 R6#1.2), MCU_Block (U1#1.21)
ADC6: CTRL_Connectors (C7#1.2 R7#1.2), MCU_Block (U1#1.22)
ADC7: CTRL_Connectors (C8#1.2 R8#1.2), MCU_Block (U1#1.23)
ADC8: CTRL_Connectors (C9#1.2 R9#1.2), MCU_Block (U1#1.26)
ADC9: CTRL_Connectors (C10.2 R10#1.2), MCU_Block (U1#1.27)
ADC10: CTRL_Connectors (C20.2 R20.2), MCU_Block (U1#1.8)
ADC11: CTRL_Connectors (C19.2 R19.2), MCU_Block (U1#1.9)
ADC12: CTRL_Connectors (C11.2 R11.2), MCU_Block (U1#1.10)
ADC13: CTRL_Connectors (C12.2 R12.2), MCU_Block (U1#1.11)
ADC14: CTRL_Connectors (C16.2 R16.2), MCU_Block (U1#1.24)
AN_IN0.L: IN_Connectors (J3.5T), ADC/ADC0 (C8_ADC0.2)
AN_IN0.R: IN_Connectors (J3.2R), ADC/ADC0 (C9_ADC0.2)
AN_IN1.L: IN_Connectors (J4.5T), ADC/ADC1 (C8_ADC1.2)
AN_IN1.R: IN_Connectors (J4.2R), ADC/ADC1 (C9_ADC1.2)
AN_IN2.L: IN_Connectors (J5.5T), ADC/ADC2 (C8_ADC2.2)
AN_IN2.R: IN_Connectors (J5.2R), ADC/ADC2 (C9_ADC2.2)
BCK: DSP/DSP0 (U1_DSP0.40), DAC/DAC0 (U1_DAC0.7)
BCK: DSP/DSP0 (U1_DSP0.57), ADC/ADC0 (U1_ADC0.17)
BCK: DSP/DSP1 (U1_DSP1.40), DAC/DAC1 (U1_DAC1.7)
BCK: DSP/DSP1 (U1_DSP1.57), ADC/ADC1 (U1_ADC1.17)
BCK: DSP/DSP2 (U1_DSP2.40), DAC/DAC2 (U1_DAC2.7)
BCK: DSP/DSP2 (U1_DSP2.57), ADC/ADC2 (U1_ADC2.17)
CLK0: DSP/DSP0 (U1_DSP0.21), CLK_Block (U2#1.3)
CLK1: DSP/DSP1 (U1_DSP1.21), CLK_Block (U2#1.8)
CLK2: DSP/DSP2 (U1_DSP2.21), CLK_Block (U2#1.5)
DAC_CTRL.DEMP0: MCU_Block (U1#1.52), DAC/DAC0 (U1_DAC0.2), DAC/DAC1 (U1_DAC1.2), DAC/DAC2 (U1_DAC2.2)
DAC_CTRL.DEMP1: MCU_Block (U1#1.51), DAC/DAC0 (U1_DAC0.3), DAC/DAC1 (U1_DAC1.3), DAC/DAC2 (U1_DAC2.3)
DAC_CTRL.FMT: MCU_Block (U1#1.53), DAC/DAC0 (U1_DAC0.1), DAC/DAC1 (U1_DAC1.1), DAC/DAC2 (U1_DAC2.1)
DAC_CTRL.MUTE: MCU_Block (U1#1.50), DAC/DAC0 (U1_DAC0.4), DAC/DAC1 (U1_DAC1.4), DAC/DAC2 (U1_DAC2.4)
DATA: DSP/DSP0 (U1_DSP0.41), DAC/DAC0 (U1_DAC0.6)
DATA: DSP/DSP1 (U1_DSP1.41), DAC/DAC1 (U1_DAC1.6)
DATA: DSP/DSP2 (U1_DSP2.41), DAC/DAC2 (U1_DAC2.6)
DIN0: DSP/DSP0 (U1_DSP0.59), ADC/ADC0 (U1_ADC0.18)
DIN0: DSP/DSP1 (U1_DSP1.59), ADC/ADC1 (U1_ADC1.18)
DIN0: DSP/DSP2 (U1_DSP2.59), ADC/ADC2 (U1_ADC2.18)
EN_SCK: MCU_Block (U1#1.2), CLK_Block (U2#1.2)
GPIO0: CTRL_Connectors (J7.8), DSP/DSP0 (R6_DSP0.2 U1_DSP0.26), DSP/DSP1 (R6_DSP1.2 U1_DSP1.26), DSP/DSP2 (R6_DSP2.2 U1_DSP2.26)
GPIO1: CTRL_Connectors (J6.8), DSP/DSP0 (R7_DSP0.1 U1_DSP0.27), DSP/DSP1 (R7_DSP1.1 U1_DSP1.27), DSP/DSP2 (R7_DSP2.1 U1_DSP2.27)
GPIO2: CTRL_Connectors (J7.10), DSP/DSP0 (R9_DSP0.2 U1_DSP0.28), DSP/DSP1 (R9_DSP1.2 U1_DSP1.28), DSP/DSP2 (R9_DSP2.2 U1_DSP2.28)
GPIO3: CTRL_Connectors (J6.10), DSP/DSP0 (R10_DSP0.1 U1_DSP0.29), DSP/DSP1 (R10_DSP1.1 U1_DSP1.29), DSP/DSP2 (R10_DSP2.1 U1_DSP2.29)
GPIO_MCU0: MCU_Block (U1#1.56), DSP/DSP0 (U1_DSP0.46), DSP/DSP1 (U1_DSP1.46), DSP/DSP2 (U1_DSP2.46)
I2C1.SCL: MCU_Block (R1#2.1 U1#1.58), DSP/DSP0 (U1_DSP0.31), DSP/DSP1 (U1_DSP1.31), DSP/DSP2 (U1_DSP2.31)
I2C1.SDA: MCU_Block (R2#2.1 U1#1.59), DSP/DSP0 (U1_DSP0.30), DSP/DSP1 (U1_DSP1.30), DSP/DSP2 (U1_DSP2.30)
I2C2.SCL: MCU_Block (R3#2.1 U1#1.29), ADC/ADC0 (U1_ADC0.24), ADC/ADC1 (U1_ADC1.24)
I2C2.SDA: MCU_Block (R4#2.1 U1#1.55), ADC/ADC0 (U1_ADC0.23), ADC/ADC1 (U1_ADC1.23)
I2C3.SCL: MCU_Block (R5#2.1 U1#1.41), ADC/ADC2 (U1_ADC2.24)
I2C3.SDA: MCU_Block (R6#2.1 U1#1.40), ADC/ADC2 (U1_ADC2.23)
LRCK: DSP/DSP0 (U1_DSP0.39), DAC/DAC0 (U1_DAC0.8)
LRCK: DSP/DSP0 (U1_DSP0.58), ADC/ADC0 (U1_ADC0.16)
LRCK: DSP/DSP1 (U1_DSP1.39), DAC/DAC1 (U1_DAC1.8)
LRCK: DSP/DSP1 (U1_DSP1.58), ADC/ADC1 (U1_ADC1.16)
LRCK: DSP/DSP2 (U1_DSP2.39), DAC/DAC2 (U1_DAC2.8)
LRCK: DSP/DSP2 (U1_DSP2.58), ADC/ADC2 (U1_ADC2.16)
NetC4_LPF0_1: LPF/LPF0 (C4_LPF0.1 R5_LPF0.2), OUT_Connectors (J9.T2-1)
NetC4_LPF1_1: LPF/LPF1 (C4_LPF1.1 R5_LPF1.2), OUT_Connectors (J9.T2-2)
NetC4_LPF2_1: LPF/LPF2 (C4_LPF2.1 R5_LPF2.2), OUT_Connectors (J9.T2-3)
NetC8_LPF0_1: LPF/LPF0 (C8_LPF0.1 R10_LPF0.2), OUT_Connectors (J9.T1-1)
NetC8_LPF1_1: LPF/LPF1 (C8_LPF1.1 R10_LPF1.2), OUT_Connectors (J9.T1-2)
NetC8_LPF2_1: LPF/LPF2 (C8_LPF2.1 R10_LPF2.2), OUT_Connectors (J9.T1-3)
NetJ2_3: IN_Connectors (J2.3), POW_Block (R7#2.1)
NetR1_LPF0_2: DAC/DAC0 (U1_DAC0.15), LPF/LPF0 (R1_LPF0.2)
NetR1_LPF1_2: DAC/DAC1 (U1_DAC1.15), LPF/LPF1 (R1_LPF1.2)
NetR1_LPF2_2: DAC/DAC2 (U1_DAC2.15), LPF/LPF2 (R1_LPF2.2)
NetR6_LPF0_2: DAC/DAC0 (U1_DAC0.14), LPF/LPF0 (R6_LPF0.2)
NetR6_LPF1_2: DAC/DAC1 (U1_DAC1.14), LPF/LPF1 (R6_LPF1.2)
NetR6_LPF2_2: DAC/DAC2 (U1_DAC2.14), LPF/LPF2 (R6_LPF2.2)
nRST: CTRL_Connectors (J8.5), MCU_Block (C9#2.2 U1#1.7)
nRST0: MCU_Block (U1#1.57), DSP/DSP0 (U1_DSP0.24)
nRST1: MCU_Block (U1#1.61), DSP/DSP1 (U1_DSP1.24)
nRST2: MCU_Block (U1#1.62), DSP/DSP2 (U1_DSP2.24)
SCKI0: DSP/DSP0 (U1_DSP0.23), DAC/DAC0 (U1_DAC0.5), ADC/ADC0 (U1_ADC0.15)
SCKI1: DSP/DSP1 (U1_DSP1.23), DAC/DAC1 (U1_DAC1.5), ADC/ADC1 (U1_ADC1.15)
SCKI2: DSP/DSP2 (U1_DSP2.23), DAC/DAC2 (U1_DAC2.5), ADC/ADC2 (U1_ADC2.15)
SWCLK: CTRL_Connectors (J8.2), MCU_Block (U1#1.49)
SWDIO: CTRL_Connectors (J8.4), MCU_Block (U1#1.46)
VCOM: DAC/DAC0 (U2_DAC0.1 U2_DAC0.2), LPF/LPF0 (U1_LPF0.3 U1_LPF0.5)
VCOM: DAC/DAC1 (U2_DAC1.1 U2_DAC1.2), LPF/LPF1 (U1_LPF1.3 U1_LPF1.5)
VCOM: DAC/DAC2 (U2_DAC2.1 U2_DAC2.2), LPF/LPF2 (U1_LPF2.3 U1_LPF2.5)

## Assembly variants
For Assembly: not fitted C1_IN_CONN J1_IN_CONN J2_IN_CONN J3_IN_CONN J4_IN_CONN J5_IN_CONN J6_CTRL J7_CTRL J8_CTRL J9_OUT_CONN J10_OUT_CONN U1_POW U2_POW U3_POW